# Altium project obc_ver111.PrjPcb (part 1 of 2)
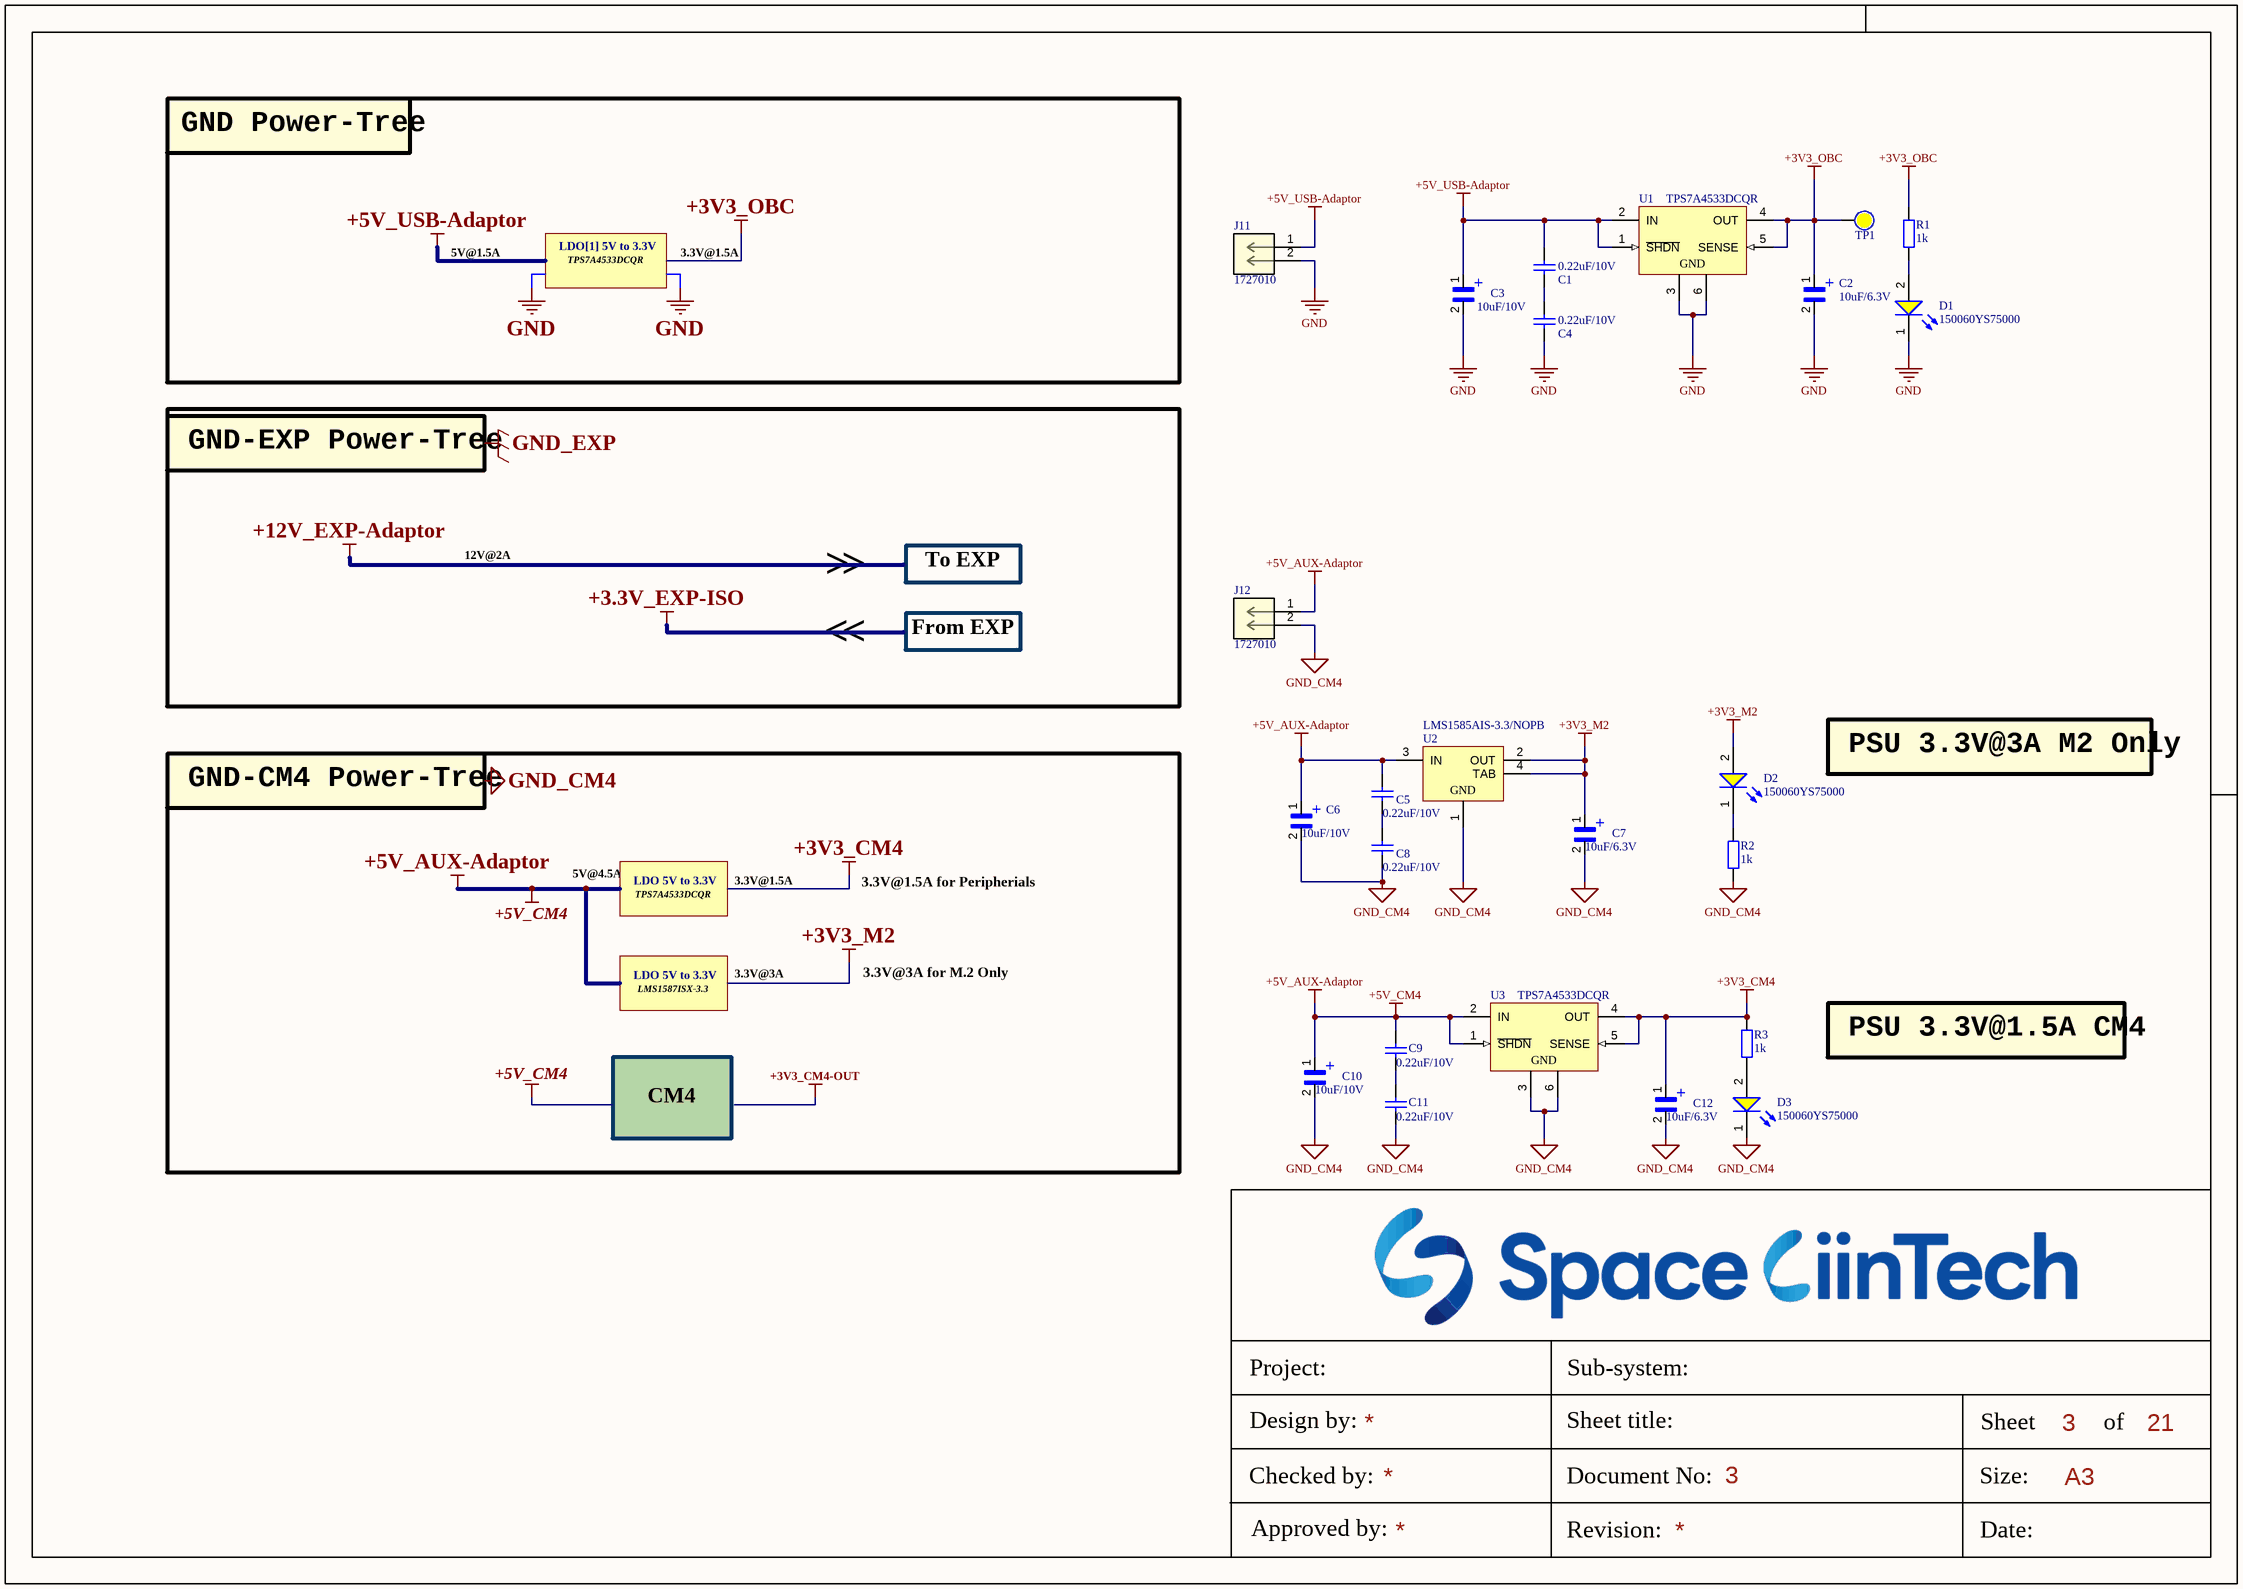
[diagram p0: obc-v2_POWER.SchDoc]
13 sheets, 279 parts. Net scope: flat (ports and power ports of the same name join across sheets).
Board file: OBC_Ver2.PcbDoc
Sheets:
  obc-v2_POWER.SchDoc
  obc-v2_RTC-WDOG.SchDoc
  obc-v2_BOARD-CONNECT.SchDoc
  obc-v2_DEBUG.SchDoc
  obc-v2_EXP-I2C-IRQ.SchDoc
  obc-v2_EXP-CAN-RS422.SchDoc
  obc-v2_CM4-M2.SchDoc
  obc-v2_CM4-PinOut.SchDoc
  obc-v2_CM4-SPI-UART.SchDoc
  obc-v2_CM4-IRQ-CTRL.SchDoc
  obc-v2_CM4-FUNCTION.SchDoc
  obc-v2_MCU-POWER.SchDoc
  obc-v2_MCU-PinOut.SchDoc

## Sheet obc-v2_POWER.SchDoc
size 420 x 297 mm; SheetNumber: 3; SheetTotal: 21

### Parts
C1  0.22uF/10V  [CAP_C_1005X60]
C2  10uF/6.3V  [CAP_MP_2012X170]
C3  10uF/10V  [CAP_MP_2012X170]
C4  0.22uF/10V  [CAP_C_1005X60]
C5  0.22uF/10V  [CAP_C_1005X60]
C6  10uF/10V  [CAP_MP_2012X170]
C7  10uF/6.3V  [CAP_MP_2012X170]
C8  0.22uF/10V  [CAP_C_1005X60]
C9  0.22uF/10V  [CAP_C_1005X60]
C10  10uF/10V  [CAP_MP_2012X170]
C11  0.22uF/10V  [CAP_C_1005X60]
C12  10uF/6.3V  [CAP_MP_2012X170]
D1  150060YS75000  [WL-SMCW_0603_150060xx75000]
D2  150060YS75000  [WL-SMCW_0603_150060xx75000]
D3  150060YS75000  [WL-SMCW_0603_150060xx75000]
J11  1727010  [CONN_1727010]
J12  1727010  [CONN_1727010]
R1  1k  [RES_C_1608X60]
R2  1k  [RES_C_1608X60]
R3  1k  [RES_C_1608X60]
TP1  (no value)  [Test Point 1 Side]  (no BOM)
U1  TPS7A4533DCQR  [DCQ0006A_M]
U2  LMS1585AIS-3.3/NOPB  [TS3B_L]
U3  TPS7A4533DCQR  [DCQ0006A_M]

### Nets
+3V3_CM4: C12.1 R3.2 U3.4(OUT) U3.5(SENSE)
+3V3_M2: C7.1 D2.2(A) U2.2(OUT) U2.4(TAB)
+3V3_OBC: C2.1 R1.2 TP1.0 U1.4(OUT) U1.5(SENSE)
+5V_AUX-Adaptor: C5.1 C6.1 C9.1 C10.1 J12.1 U2.3(IN) U3.1(~{SHDN}) U3.2(IN)  [also labelled +5V_CM4]
+5V_USB-Adaptor: C1.1 C3.1 J11.1 U1.1(~{SHDN}) U1.2(IN)
GND: C2.2 C3.2 C4.2 D1.1(K) J11.2 U1.3(GND) U1.6(GND)
GND_CM4: C6.2 C7.2 C8.2 C10.2 C11.2 C12.2 D3.1(K) J12.2 R2.2 U2.1(GND) U3.3(GND) U3.6(GND)
NetC1_2: C1.2 C4.1
NetC5_2: C5.2 C8.1
NetC9_2: C9.2 C11.1
NetD1_2: D1.2(A) R1.1
NetD2_1: D2.1(K) R2.1
NetD3_2: D3.2(A) R3.1

### Notes on the sheet
- GND Power-Tree
- 5V@1.5A
- LDO[1] 5V to 3.3V
- TPS7A4533DCQR
- 3.3V@1.5A
- GND-EXP Power-Tree
- 12V@2A
- >
- To EXP
- <
- From EXP
- GND-CM4 Power-Tree
- PSU 3.3V@3A M2 Only
- 5V@4.5A
- LDO 5V to 3.3V
- 3.3V@1.5A for Peripherials
- LMS1587ISX-3.3
- 3.3V@3A
- 3.3V@3A for M.2 Only
- PSU 3.3V@1.5A CM4
- CM4
- Labels drawn without touching a wire or pin: GND, GND_CM4, GND_EXP
- Project:
- Sub-system:
- Design by:
- Sheet title:
- Sheet
- A3
- of
- Checked by:
- Approved by:
- Revision:
- Document No:
- Size:
- Date:
- (in symbol TACR686M003RTA) +

### Library data of the parts
C1 C4 C5 C8 C9 C11 = Tu 0402 33nF 10V: CAPC; Chung_Loai: Dán; Don_Vi: Con; So_Chan: 2; Ten_Linh_Kien: Tụ 0402 33nF X7R 10V GRM155R71A333KA01D; Ma_Hang: MH007853; Kieu_Chan: *
C2 C3 C6 C7 C10 C12 = TACR686M003RTA: CAPP; MF: AVX; Availability: Unavailable; SnapEDA_Link: https://www.snapeda.com/parts/TACR686M003RTA/AVX/view-part/1745975/?ref=snap; MP: TACR686M003RTA; Value: *; Price: None; Package: 0805 AVX
D1-D3 = CMP-1426-00005-2: LED YELLOW CLEAR 0603 SMD; NexarPartId: 29687085; Wavelength: 590nm; Luminous Intensity: 120mcd; Peak Wavelength: 595nm; Forward Current: 100mA; Power Dissipation: 72mW; Forward Voltage: 2V; Test Current: 20mA; Reverse Voltage: 5V; Lens Style: Clear, Rectangular; Max Junction Temperature (Tj): 95°C; Viewing Angle: 140°; Case Code (Imperial): 0603; Height: 700µm; REACH SVHC: Unknown; Dominant Wavelength: 590nm; Min Operating Temperature: -40°C; Color: Yellow; Width: 800µm; Mount: Surface Mount; Packaging: Tape and Reel; Max Operating Temperature: 85°C; RoHS: Compliant; Max Reverse Voltage (DC): 5V; Case Code (Metric): 1608; Length: 1.6mm; Case/Package: 0603
J11 J12 = 1727010: No Description Available; Mfr_Name: Phoenix Contact; RefDes: RefDes; Type: Type
R1-R3 = Tro 0603 1% 10k: RES; Chung_Loai: Dán; Don_Vi: Con; So_Chan: 2; Ten_Linh_Kien: Trở 0603 1% 10k; Ma_Hang: MH006333; Kieu_Chan: *
TP1 = Test Point: Solder: NF
U1 U3 = CMP-0395-00360-2: Single Output Fast Transient Response LDO, 1.5 A, Fixed 3.3 V Output, 2.1 to 20 V Input, 6-pin SOT-223 (DCQ), -40 to 125 degC, Green (RoHS & no Sb/Br); Manufacturer: Texas Instruments; Vout Adj(Max)(V): 3.3; Vin(Max)(V): 20; Accuracy(%): 1; SubFamily: Single Channel LDO; Vin(Min)(V): 2.1; Iout(Max)(A): 1.5; Vdo(Typ)(mV): 300; Eco-Plan: Green (RoHS & no Sb/Br); Mounting Technology: Surface Mount; PackageDescription: 6-Pin Plastic Small Outline, Body 3.5 x 6.5 mm, Pitch 1.27 mm; ComponentLink2URL: http://www.ti.com/general/docs/lit/getliterature.tsp?genericPartNumber=TPS7A4533&fileType=pdf; PackageReference: DCQ0006A; ComponentLink3Description: Package Specification; ComponentLink2Description: Datasheet; Fixed Output Options(V): 3.3; Iq(Typ)(mA): 1; ComponentLink1URL: http://www.ti.com/; PartNumber: TPS7A4533DCQR; ComponentLink1Description: Manufacturer URL; PackageVersion: 4202109/D; Vout Adj(Min)(V): 3.3; DatasheetVersion: SLVS720D; ComponentLink3URL: http://www.ti.com/litv/pdf/mpds098c
U2 = CMP-0062-00180-3: 3A Low Dropout Fast Response Regulators, 3-pin TO-263, Pb-Free; PartNumber: LMS1587ISX-3.3/NOPB; Manufacturer: National Semiconductor; PowerWise: N; High-Reliability: Y; PackageTopMarking: NSUZXYTTE#*LMS1587*IS-3.3; CompType: LDO IC; ComponentLink1Description: Manufacturer URL; PackageReference: TS3B; ComponentLink1URL: http://www.national.com/; ComponentLink2URL: http://www.national.com/ds/LM/LMS1587.pdf; DatasheetVersion: Jun-2005; ComponentLink3URL: http://www.national.com/pf/LM/LMS1587.html; RevisionNote: SCH symbol layout adjusted; PinCount: 3; RoHS: Y; Code_JEDEC: MO-169-AA; PackageDescription: TO-263, Molded, .400 x .390 x .180in, 3 Lead, .1in Pitch, Surface Mount; ComponentLink4Description: TS3B Package Page; ComponentLink3Description: LMS1587 Web Page; PackageVersion: revF, Apr-2005; ComponentLink2Description: LMS1587 Datasheet; ComponentLink4URL: http://www.national.com/packaging/folders/ts3b.html

## Sheet obc-v2_RTC-WDOG.SchDoc
size 420 x 297 mm; SheetNumber: 6; SheetTotal: 21
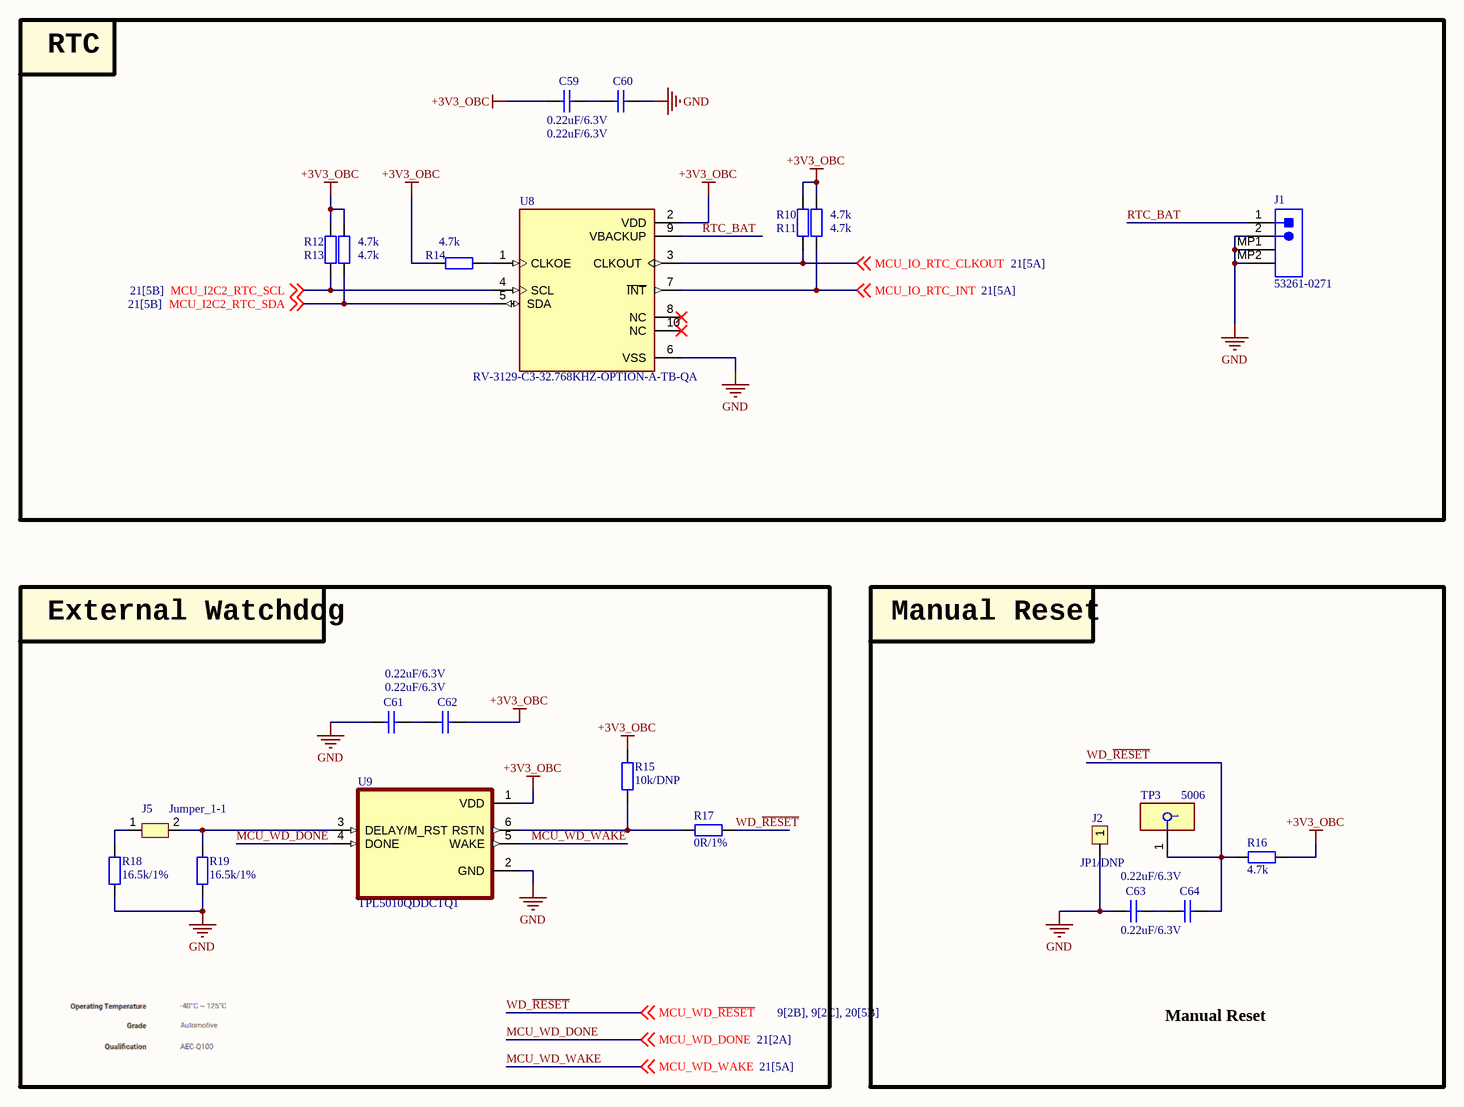
[diagram p1: obc-v2_RTC-WDOG.SchDoc]

### Parts
C59  0.22uF/6.3V  [CAP_C_1005X60]
C60  0.22uF/6.3V  [CAP_C_1005X60]
C61  0.22uF/6.3V  [CAP_C_1005X60]
C62  0.22uF/6.3V  [CAP_C_1005X60]
C63  0.22uF/6.3V  [CAP_C_1005X60]
C64  0.22uF/6.3V  [CAP_C_1005X60]
J1  53261-0271  [MOLX-53261-0271_V]
J2  JP1/DNP  [JP1-D1T]
J5  Jumper_1-1  [Jumper_1-1]
R10  4.7k  [RES_C_1608X60]
R11  4.7k  [RES_C_1608X60]
R12  4.7k  [RES_C_1608X60]
R13  4.7k  [RES_C_1608X60]
R14  4.7k  [RES_C_1608X60]
R15  10k/DNP  [RES_C_1608X60]
R16  4.7k  [RES_C_1608X60]
R17  0R/1%  [RES_C_1608X60]
R18  16.5k/1%  [RES_C_1608X60]
R19  16.5k/1%  [RES_C_1608X60]
TP3  5006  [FP-5006-MFG]
U8  RV-3129-C3-32.768KHZ-OPTION-A-TB-QA  [IC_RV-3129-C3_32.768KHZ_OPTION_A_TB_QA]
U9  TPL5010QDDCTQ1  [SOT95P280X110-6N]

### Blocks framed on the sheet
RTC: C59 C60 J1 R10-R14 U8
External Watchdog: C61 C62 J5 R15 R17-R19 U9
Manual Reset: C63 C64 J2 R16 TP3

### Nets
+3V3_OBC: C59.2 C62.1 R10.2 R11.2 R12.2 R13.2 R14.2 R15.2 R16.2 U8.2(VDD) U9.1(VDD)
GND: C60.1 C61.2 C63.2 J1.2 J1.MP1 J1.MP2 J2.1 R18.1 R19.1 U8.6(VSS) U9.2(GND)
MCU_I2C2_RTC_SCL: R13.1 U8.4(SCL) ; off-sheet MCU_I2C2_RTC_SCL
MCU_I2C2_RTC_SDA: R12.1 U8.5(SDA) ; off-sheet MCU_I2C2_RTC_SDA
MCU_IO_RTC_CLKOUT: R11.1 U8.3(CLKOUT) ; off-sheet MCU_IO_RTC_CLKOUT
MCU_IO_RTC_INT: R10.1 U8.7(~{INT}) ; off-sheet MCU_IO_RTC_INT
MCU_WD_DONE: U9.4(DONE) ; off-sheet MCU_WD_DONE
MCU_WD_~{RESET}: C64.1 R16.1 R17.1 TP3.1 ; off-sheet MCU_WD_~{RESET}  [also labelled WD_~{RESET}]  [project net MCU_~{RST}]
MCU_WD_WAKE: U9.5(WAKE) ; off-sheet MCU_WD_WAKE
RTC_BAT: J1.1 U8.9(VBACKUP)
NetC59_1: C59.1 C60.2
NetC61_1: C61.1 C62.2
NetC63_1: C63.1 C64.2
NetJ5_1: J5.1 R18.2
NetJ5_2: J5.2 R19.2 U9.3(DELAY/M_RST)
NetR14_1: R14.1 U8.1(CLKOE)
NetR15_1: R15.1 R17.2 U9.6(RSTN)

Not connected (* = marked no-connect by the designer): U8 8(NC)* 10(NC)*

### Notes on the sheet
- Manual Reset
- Project:
- Sub-system:
- Design by:
- Sheet title:
- Sheet
- A3
- of
- Checked by:
- Approved by:
- Revision:
- Document No:
- Size:
- Date:

### Library data of the parts
C59-C64 = Tu 0402 33nF 10V: as C1 on sheet obc-v2_POWER; Kieu_Chan: *
J1 = CMP-2000-05633-1: PicoBlade(TM) Header, Right Angle, -40 to 85 degC, 2-Pin SMD, RoHS, Tape and Reel; Current - Max: 1A; Brand: Molex; Voltage Rating: 125V; Number of Positions: 2; Pitch: 1.25mm; Package Version: Rev. H, 11/2014; Factory Pack Quantity: 1000; Datasheet URL: http://www.molex.com/webdocs/datasheets/pdf/en-us/0532610271_PCB_HEADERS.pdf; Datasheet Version: 03/2016; Housing Material: Thermoplastic; RoHS: Details; Product Type: Headers; Number of Rows: 1; Termination Style: SMD; Mounting Technology: SurfaceMount; Number of Positions / Contacts: 2; Package URL: http://www.molex.com/pdm_docs/sd/532610271_sd.pdf; Mounting Angle: Right; Mounting Style: SMD/SMT; Manufacturer: Molex; Product Category: 1.25mmConnectors; Tradename: PicoBlade; Voltage - Max: 125V; Manufacturer URL: http://www.molex.com/; Series: 53261; Package Description: 2-Leads Header, Pitch 1.25 mm, Mated Height 3.4 mm; Package Reference: 53261-0271; Current Rating: 1A; Contact Plating: Tin; Contact Material: PhosphorBronze; Type: Shrouded; Packaging: Reel
J2 = JP1: WR-PHD 2.54 mm Angled Socket Header; Manufacturer: W¨¹rth Elektronik eiSos GmbH; partNo: 613002143121; ComponentLink1 Description: Manufacturer; ComponentLink2 Description: Datasheet; NoPins: 02; Created Date: 29 March 2013; ComponentLink1URL: http://www.we-online.com; ComponentLink2URL: http://katalog.we-online.de/em/datasheet/6130xx143121.pdf; Created by: Karrer Zheng
J5 = Jumper_1_1
R10-R14 R16 R17 = Tro 0603 1% 10k: as R1 on sheet obc-v2_POWER; Kieu_Chan: *
R15 = Tro 0603 1% 10k: RES SMD 10K OHM 1% 1/10W 0603, P/N: ERJ-3EKF1002V; Chung_Loai: Dán; Don_Vi: Con; So_Chan: 2; Ten_Linh_Kien: Trở 0603 1% 10k; Ma_Hang: MH006333; Kieu_Chan: *
R18 = Tro 0603 1% 10k: RES SMD 19.1K OHM 1% 1/10W 0603, P/N: ERJ-3EKF1912V; Chung_Loai: Dán; Don_Vi: Con; So_Chan: 2; Ten_Linh_Kien: Trở 0603 1% 10k; Ma_Hang: MH006333; Kieu_Chan: *
R19 = Tro 0603 1% 10k: RES SMD 16.5K OHM 1% 1/10W 0603, P/N: ERJ-3EKF1652V; Chung_Loai: Dán; Don_Vi: Con; So_Chan: 2; Ten_Linh_Kien: Trở 0603 1% 10k; Ma_Hang: MH006333; Kieu_Chan: *
TP3 = CMP-19636-000022-1: PC TEST POINT COMPACT BLACK; Body Material: Bronze; Inside Diameter: 1.78mm; Number of Ports: 1; Hole Diameter: 1.6mm; Outside Diameter: 3.18mm; Plating: Silver; Contact Plating: Tin; Color: Black; RoHS Compliant: Yes; Flammability Rating: UL94 V-0; Contact Material: Bronze; Material: Nylon; Orientation: Straight; Package Quantity: 100; Housing Color: Black; Length: 8.89mm; Series: THM; Mount: PCB; Height: 0.35inch; Packaging: Bulk; REACH SVHC: No SVHC; Insulation Material: Nylon; Lead Free: Lead Free
U8 = RV-3129-C3_32.768KHZ_OPTION_A_TB_QA: Real-Time Clock Module, Temperature compensated, in 2.5 x 3.7 mm package; MF: Micro Crystal; MP: RV-3129-C3 32.768KHZ OPTION A TB QA; SnapEDA_Link: https://www.snapeda.com/parts/RV-3129-C3%2032.768KHZ%20OPTION%20A%20TB%20QA/Micro+Crystal/view-part/?ref=snap; Package: QFN-10 Micro Crystal; Value: *; Check_prices: https://www.snapeda.com/parts/RV-3129-C3%2032.768KHZ%20OPTION%20A%20TB%20QA/Micro+Crystal/view-part/?ref=eda
U9 = TPL5010QDDCTQ1: Package: None; Price: None; Value: *; MP: TPL5010QDDCTQ1; Availability: Unavailable

## Sheet obc-v2_BOARD-CONNECT.SchDoc
size 420 x 297 mm; SheetNumber: 8; SheetTotal: 21
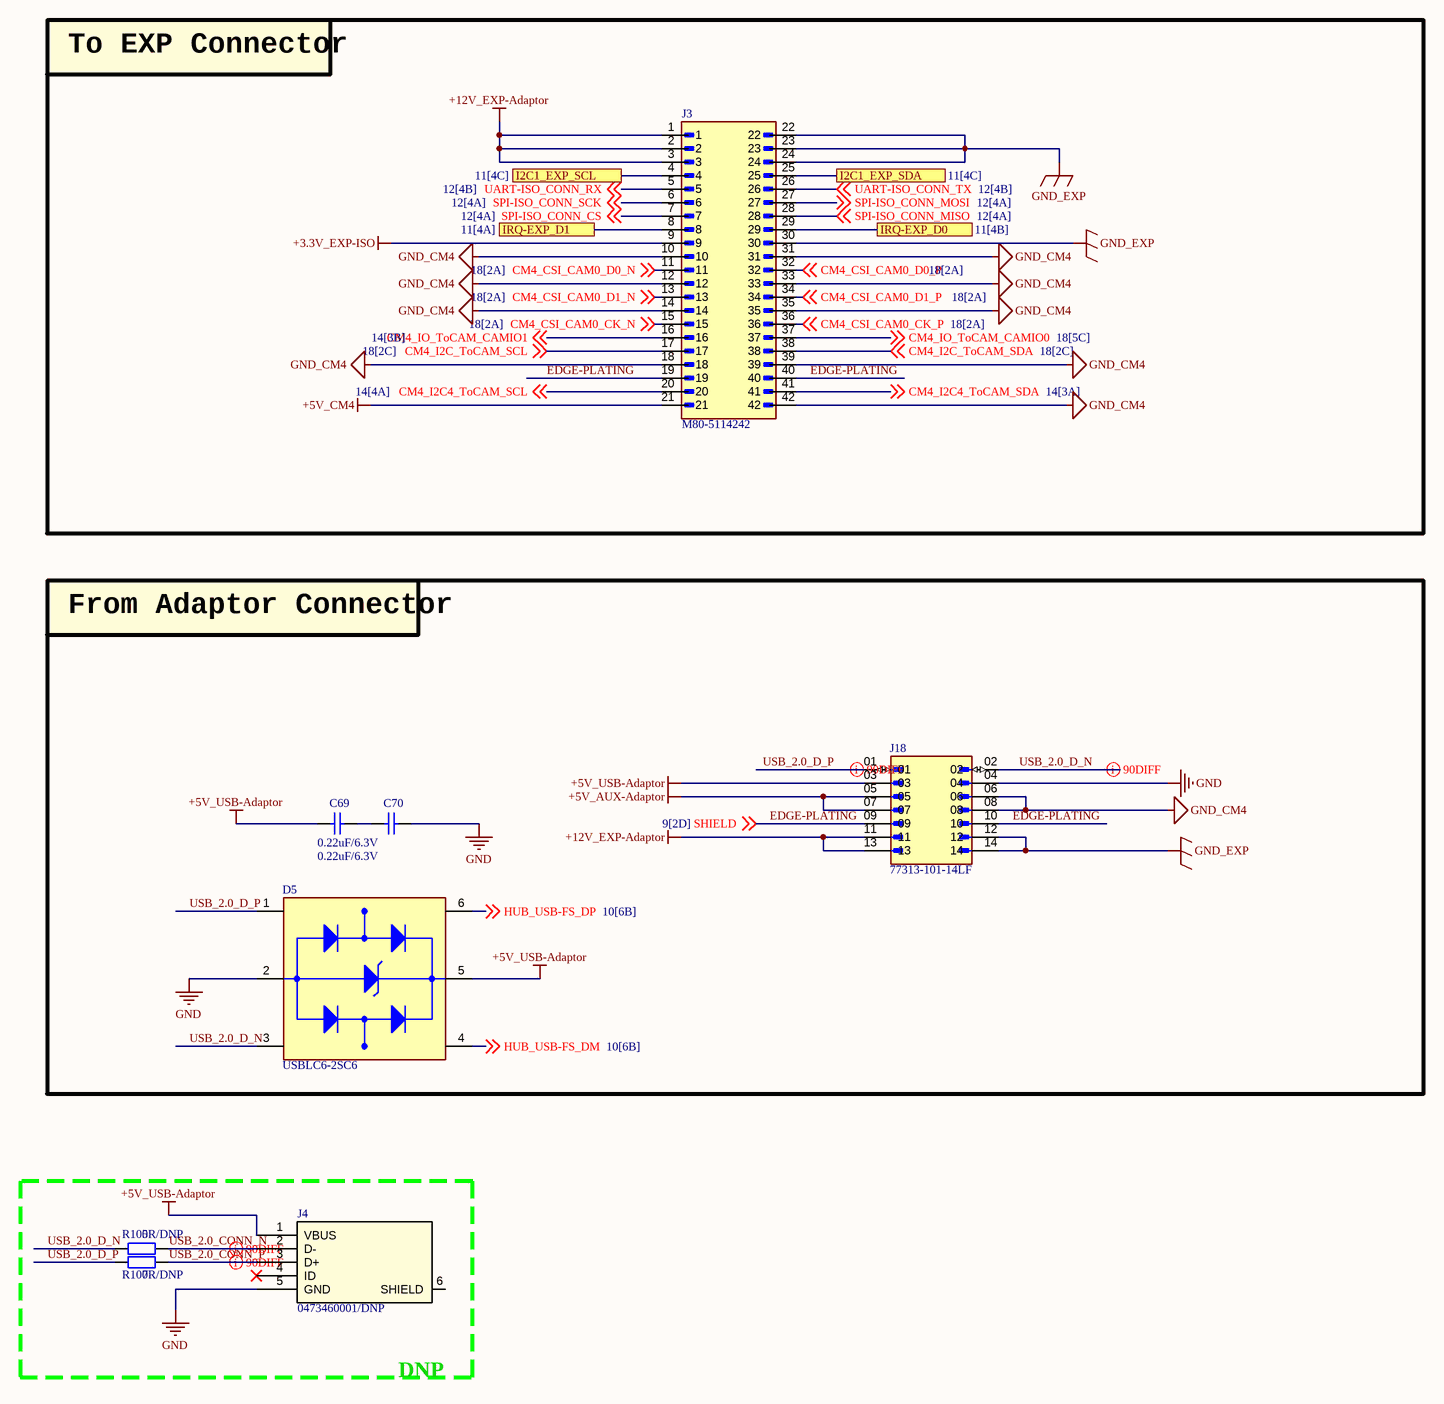
[diagram p2: obc-v2_BOARD-CONNECT.SchDoc]

### Parts
C69  0.22uF/6.3V  [CAP_C_1005X60]
C70  0.22uF/6.3V  [CAP_C_1005X60]
D5  USBLC6-2SC6  [SOT95P280X145-6N]
J3  M80-5114242  [HARWIN_M80-5114242 - duplicate]
J4  0473460001/DNP  [47346-0001_MOL]
J18  77313-101-14LF  [AMPHENOL_77313-101-14LF]
R105  0R/DNP  [RES_C_1608X60]
R107  0R/DNP  [RES_C_1608X60]

### Blocks framed on the sheet
To EXP Connector: J3
From Adaptor Connector: C69 C70 D5 J18

### Ports
I2C1_EXP_SCL (see 11[4C]), I2C1_EXP_SDA (see 11[4C]), IRQ-EXP_D0 (see 11[4B]), IRQ-EXP_D1 (see 11[4A])

### Nets
+3.3V_EXP-ISO: J3.9
+5V_AUX-Adaptor: J3.21 J18.05 J18.07  [also labelled +5V_CM4]
+5V_USB-Adaptor: C69.2 D5.5(VBUS) J4.1(VBUS) J18.03
+12V_EXP-Adaptor: J3.1 J3.2 J3.3 J18.11 J18.13
GND: C70.1 D5.2(GND) J4.5(GND) J18.04
GND_CM4: J3.10 J3.12 J3.14 J3.18 J3.31 J3.33 J3.35 J3.39 J3.42 J18.06 J18.08
GND_EXP: J3.22 J3.23 J3.24 J3.30 J18.12 J18.14
CM4_CSI_CAM0_CK_N: J3.15 ; off-sheet CM4_CSI_CAM0_CK_N
CM4_CSI_CAM0_CK_P: J3.36 ; off-sheet CM4_CSI_CAM0_CK_P
CM4_CSI_CAM0_D0_N: J3.11 ; off-sheet CM4_CSI_CAM0_D0_N
CM4_CSI_CAM0_D0_P: J3.32 ; off-sheet CM4_CSI_CAM0_D0_P
CM4_CSI_CAM0_D1_N: J3.13 ; off-sheet CM4_CSI_CAM0_D1_N
CM4_CSI_CAM0_D1_P: J3.34 ; off-sheet CM4_CSI_CAM0_D1_P
CM4_I2C4_ToCAM_SCL: J3.20 ; off-sheet CM4_I2C4_ToCAM_SCL
CM4_I2C4_ToCAM_SDA: J3.41 ; off-sheet CM4_I2C4_ToCAM_SDA
CM4_I2C_ToCAM_SCL: J3.17 ; off-sheet CM4_I2C_ToCAM_SCL
CM4_I2C_ToCAM_SDA: J3.38 ; off-sheet CM4_I2C_ToCAM_SDA
CM4_IO_ToCAM_CAMIO0: J3.37 ; off-sheet CM4_IO_ToCAM_CAMIO0
CM4_IO_ToCAM_CAMIO1: J3.16 ; off-sheet CM4_IO_ToCAM_CAMIO1
EDGE-PLATING: J3.19 J3.40 J18.09 J18.10 ; off-sheet SHIELD  [also labelled SHIELD]
HUB_USB-FS_DM: D5.4(I/O2_OUT) ; off-sheet HUB_USB-FS_DM
HUB_USB-FS_DP: D5.6(I/O1_OUT) ; off-sheet HUB_USB-FS_DP
SPI-ISO_CONN_CS: J3.7 ; off-sheet SPI-ISO_CONN_CS
SPI-ISO_CONN_MISO: J3.28 ; off-sheet SPI-ISO_CONN_MISO
SPI-ISO_CONN_MOSI: J3.27 ; off-sheet SPI-ISO_CONN_MOSI
SPI-ISO_CONN_SCK: J3.6 ; off-sheet SPI-ISO_CONN_SCK
UART-ISO_CONN_RX: J3.5 ; off-sheet UART-ISO_CONN_RX
UART-ISO_CONN_TX: J3.26 ; off-sheet UART-ISO_CONN_TX
USB_2.0_CONN_N: J4.2(D-) R105.1
USB_2.0_CONN_P: J4.3(D+) R107.1
USB_2.0_D_N: D5.3(I/O2_IN) J18.02 R105.2
USB_2.0_D_P: D5.1(I/O1_IN) J18.01 R107.2
NetC69_1: C69.1 C70.2
NetJ3_4: J3.4 ; port I2C1_EXP_SCL
NetJ3_8: J3.8 ; port IRQ-EXP_D1
NetJ3_25: J3.25 ; port I2C1_EXP_SDA
NetJ3_29: J3.29 ; port IRQ-EXP_D0

Not connected (* = marked no-connect by the designer): J4 4(ID)* 6(SHIELD)

### Layout directives
differential pair; differential pair class DIFF90: USB_2.0_CONN_N, USB_2.0_CONN_P, USB_2.0_D_N, USB_2.0_D_P

### Notes on the sheet
- DNP
- Project:
- Sub-system:
- Design by:
- Sheet title:
- Sheet
- A3
- of
- Checked by:
- Approved by:
- Revision:
- Document No:
- Size:
- Date:

### Library data of the parts
C69 C70 = Tu 0402 33nF 10V: as C1 on sheet obc-v2_POWER; Kieu_Chan: *
D5 = USBLC6-2SC6: 17V Clamp 5A (8/20Âµs) Ipp Tvs Diode Surface Mount SOT-23-6; MF: STMicroelectronics; Value: *; SnapEDA_Link: https://www.snapeda.com/parts/USBLC6-2SC6/STMicroelectronics/view-part/?ref=snap; Check_prices: https://www.snapeda.com/parts/USBLC6-2SC6/STMicroelectronics/view-part/?ref=eda; Purchase-URL: https://pricing.snapeda.com/search/part/USBLC6-2SC6/?ref=eda; Price: None; Availability: In Stock; Package: SOT-23-6 STMicroelectronics; MP: USBLC6-2SC6
J4 = USB_micro: No Description Available; Mfr_Name: Molex Connector Corporation; RefDes: RefDes; Type: Type
J18 = 77313-101-14LF: MF: AMPHENOL ICC / FCI; Package: None; Price: None; Value: *; MP: 77313-101-14LF; Availability: Unavailable
R105 R107 = Tro 0603 1% 1k: RES SMD 12K OHM 1% 1/10W 0603, P/N: ERJ-3EKF1202V; Chung_Loai: Dán; So_Chan: 2; Don_Vi: Con; Ten_Linh_Kien: Trở 0603 1% 1k; Ma_Hang: MH006334; Kieu_Chan: *
J3 = M80-5114242: Package: None; Price: None; Value: *; MP: M80-5114242; Availability: Unavailable

## Sheet obc-v2_DEBUG.SchDoc
size 420 x 297 mm; SheetNumber: 9; SheetTotal: 21
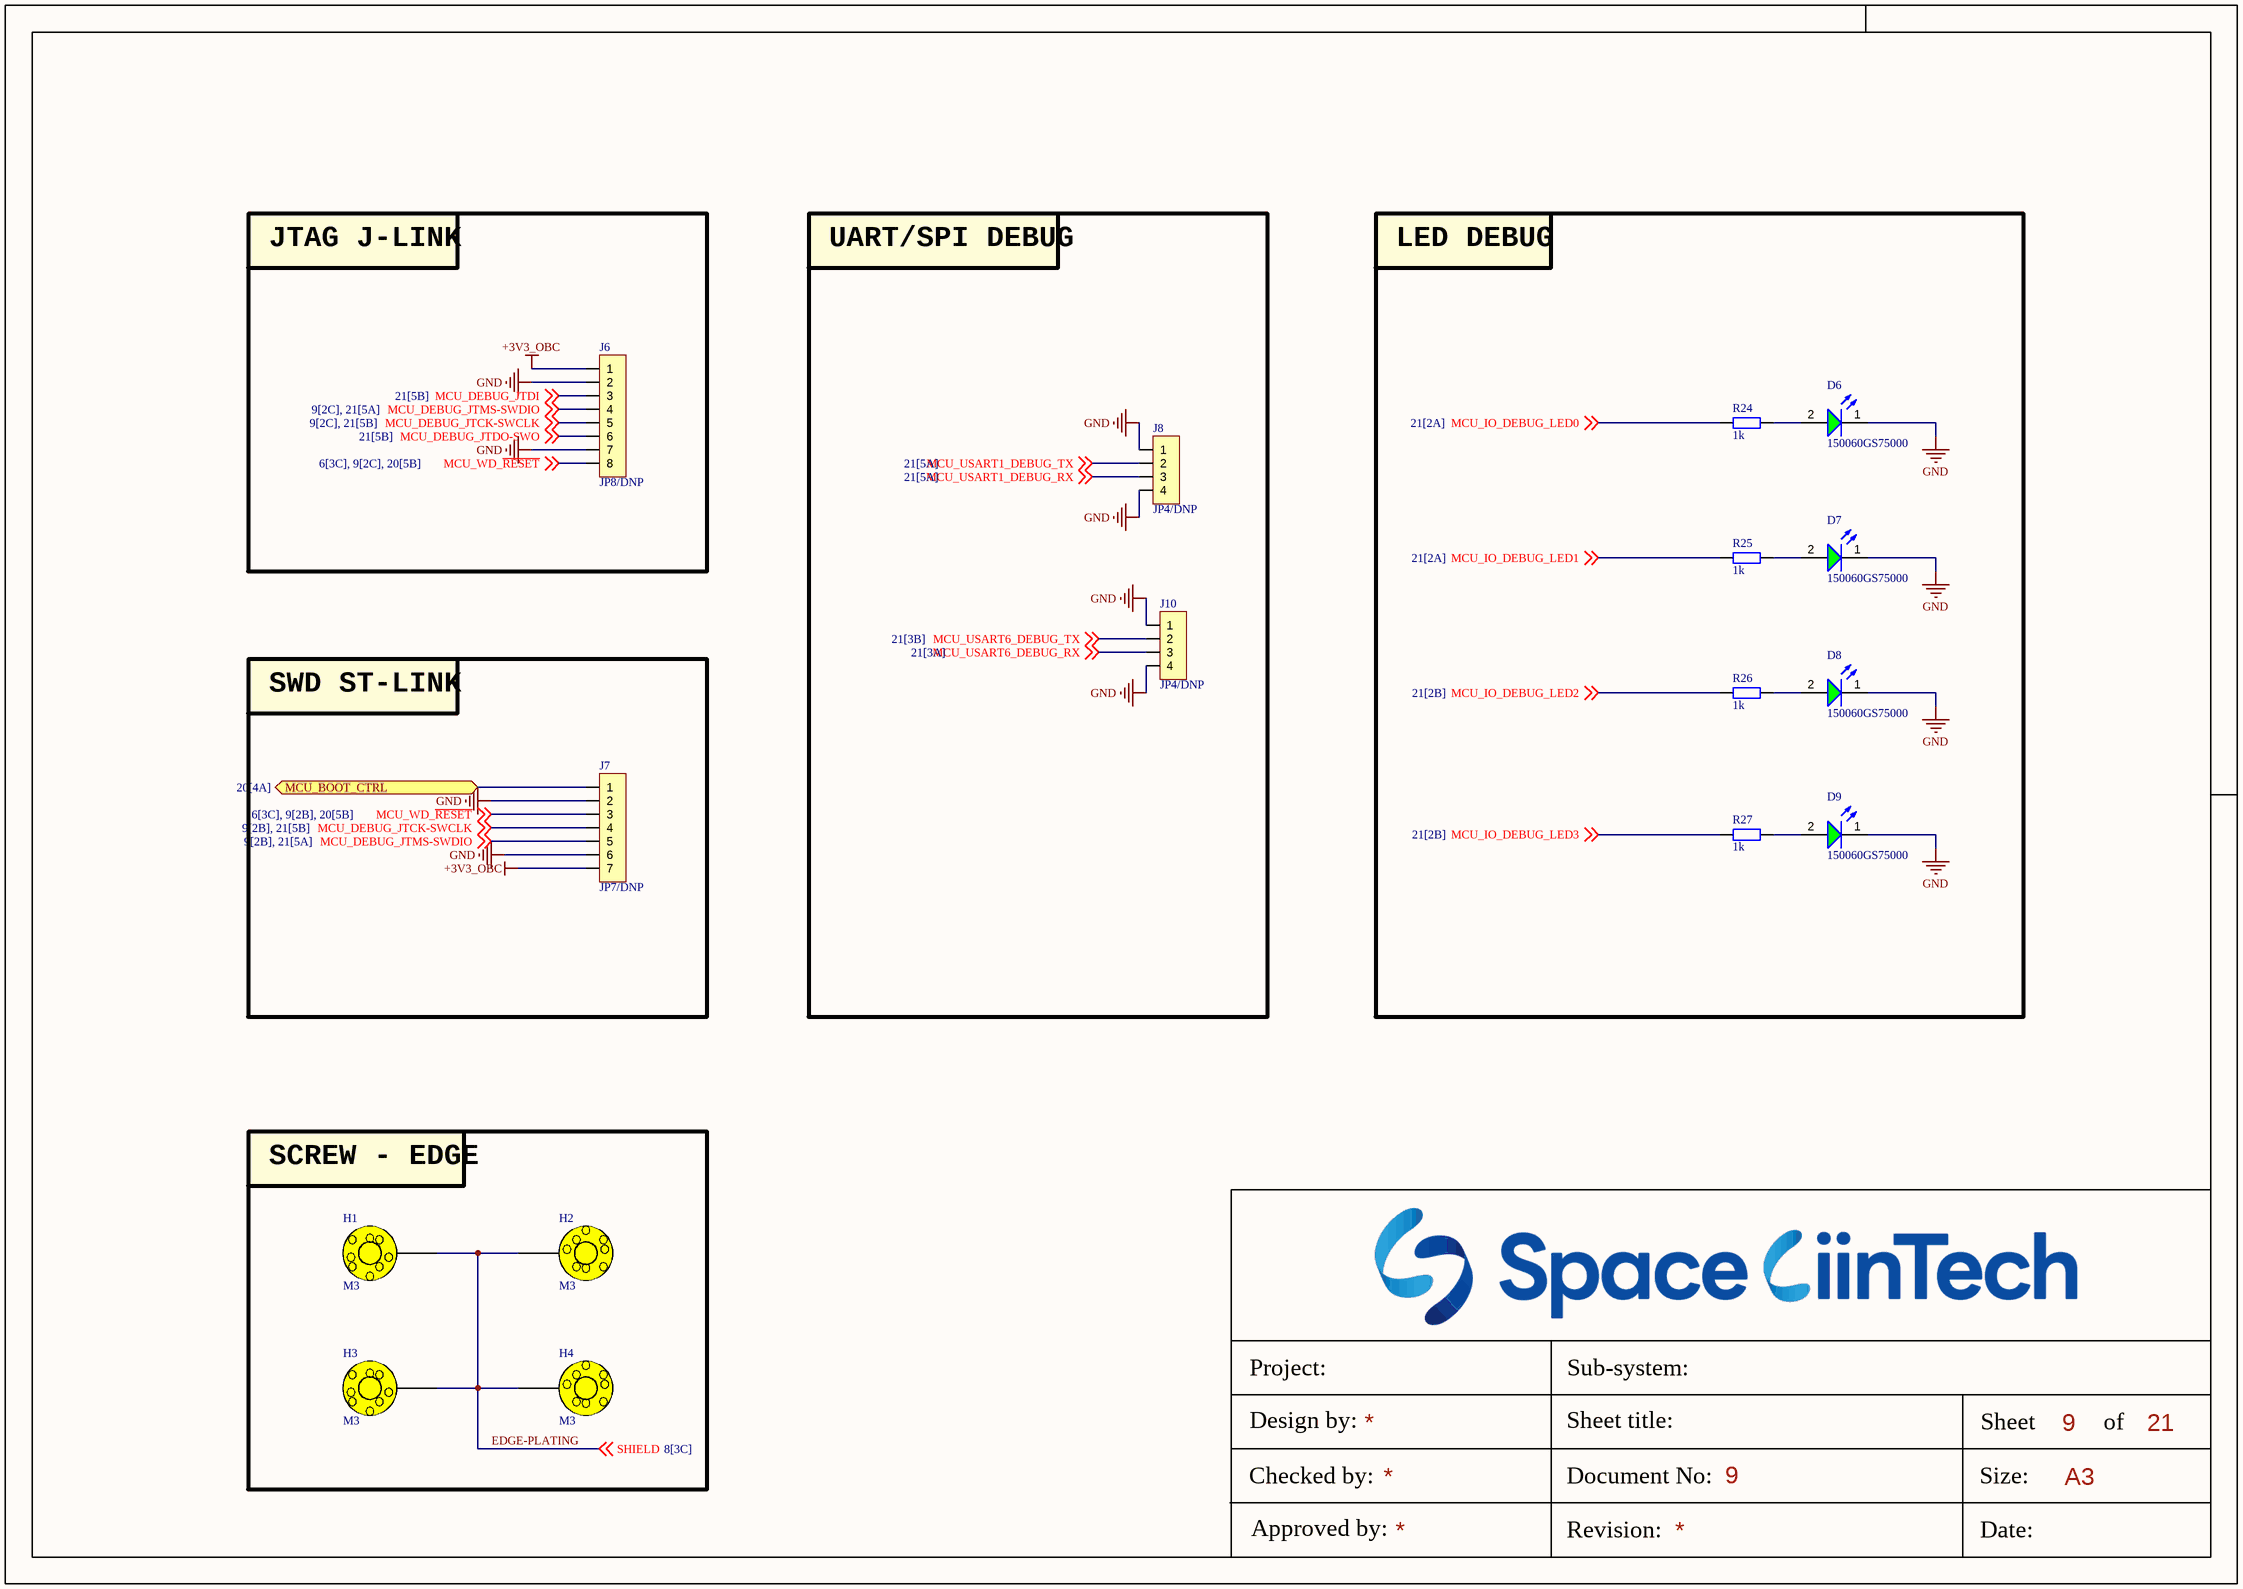
[diagram p3: obc-v2_DEBUG.SchDoc]

### Parts
D6  150060GS75000  [WL-SMCW_0603_150060xx75000]
D7  150060GS75000  [WL-SMCW_0603_150060xx75000]
D8  150060GS75000  [WL-SMCW_0603_150060xx75000]
D9  150060GS75000  [WL-SMCW_0603_150060xx75000]
H1  M3  [HEX-M3]
H2  M3  [HEX-M3]
H3  M3  [HEX-M3]
H4  M3  [HEX-M3]
J6  JP8/DNP  [JP8-C1T]
J7  JP7/DNP  [JP7-C1T]
J8  JP4/DNP  [JP4-C1T]
J10  JP4/DNP  [JP4-C1T]
R24  1k  [RES_C_1608X60]
R25  1k  [RES_C_1608X60]
R26  1k  [RES_C_1608X60]
R27  1k  [RES_C_1608X60]

### Blocks framed on the sheet
JTAG J-LINK: J6
UART/SPI DEBUG: J8 J10
LED DEBUG: D6-D9 R24-R27
SWD ST-LINK: J7
SCREW - EDGE: H1-H4

### Ports
MCU_BOOT_CTRL (bidir, see 20[4A])

### Nets
+3V3_OBC: J6.1 J7.7
GND: D6.1(K) D7.1(K) D8.1(K) D9.1(K) J6.2 J6.7 J7.2 J7.6 J8.1 J8.4 J10.1 J10.4
EDGE-PLATING: H1.1 H2.1 H3.1 H4.1 ; off-sheet SHIELD  [also labelled SHIELD]
MCU_BOOT0: J7.1 ; port MCU_BOOT_CTRL
MCU_DEBUG_JTCK-SWCLK: J6.5 J7.4 ; off-sheet MCU_DEBUG_JTCK-SWCLK
MCU_DEBUG_JTDI: J6.3 ; off-sheet MCU_DEBUG_JTDI
MCU_DEBUG_JTDO-SWO: J6.6 ; off-sheet MCU_DEBUG_JTDO-SWO
MCU_DEBUG_JTMS-SWDIO: J6.4 J7.5 ; off-sheet MCU_DEBUG_JTMS-SWDIO
MCU_IO_DEBUG_LED0: R24.2 ; off-sheet MCU_IO_DEBUG_LED0
MCU_IO_DEBUG_LED1: R25.2 ; off-sheet MCU_IO_DEBUG_LED1
MCU_IO_DEBUG_LED2: R26.2 ; off-sheet MCU_IO_DEBUG_LED2
MCU_IO_DEBUG_LED3: R27.2 ; off-sheet MCU_IO_DEBUG_LED3
MCU_USART1_DEBUG_RX: J8.3 ; off-sheet MCU_USART1_DEBUG_RX
MCU_USART1_DEBUG_TX: J8.2 ; off-sheet MCU_USART1_DEBUG_TX
MCU_USART6_DEBUG_RX: J10.3 ; off-sheet MCU_USART6_DEBUG_RX
MCU_USART6_DEBUG_TX: J10.2 ; off-sheet MCU_USART6_DEBUG_TX
MCU_WD_~{RESET}: J6.8 J7.3 ; off-sheet MCU_WD_~{RESET}  [project net MCU_~{RST}]
NetD6_2: D6.2(A) R24.1
NetD7_2: D7.2(A) R25.1
NetD8_2: D8.2(A) R26.1
NetD9_2: D9.2(A) R27.1

### Notes on the sheet
- Project:
- Sub-system:
- Design by:
- Sheet title:
- Sheet
- A3
- of
- Checked by:
- Approved by:
- Revision:
- Document No:
- Size:
- Date:

### Library data of the parts
D6-D9 = CMP-1426-00002-4: 430mcd Colorless transparence 520nm Emerald 140° LED0603 Light Emitting Diodes (LED) ROHS; Peak Wavelength: 515nm; Forward Current: 100mA; Reverse Voltage: 5V; Output Current: 10µA; Power Dissipation: 105mW; Lens Style: Clear, Rectangular; Dominant Wavelength: 525nm; Color: Green; Test Current: 20mA; Max Junction Temperature (Tj): 95°C; Forward Voltage: 3.2V; Width: 800µm; Max Operating Temperature: 85°C; Case Code (Metric): 1608; Luminous Intensity: 430mcd; Lead Free: Lead Free; Case/Package: 0603; Case Code (Imperial): 0603; Mount: Surface Mount; Max Reverse Voltage (DC): 5V; Packaging: Tape and Reel; RoHS: Compliant; Viewing Angle: 140°; REACH SVHC: Unknown; Min Operating Temperature: -40°C; Height: 700µm; Wavelength: 525nm; Length: 1.6mm
H1-H4 = HEX-M3
J6 = JP8
J7 = JP7
J8 J10 = JP4: WR-PHD 2.54 mm Angled Socket Header; Manufacturer: W¨¹rth Elektronik eiSos GmbH; partNo: 613004143121; ComponentLink1 Description: Manufacturer; ComponentLink2 Description: Datasheet; NoPins: 04; Created Date: 29 March 2013; ComponentLink1URL: http://www.we-online.com; ComponentLink2URL: http://katalog.we-online.de/em/datasheet/6130xx143121.pdf; Created by: Karrer Zheng
R24-R27 = Tro 0603 1% 10k: as R1 on sheet obc-v2_POWER; Kieu_Chan: *

## Sheet obc-v2_EXP-I2C-IRQ.SchDoc
size 420 x 297 mm; SheetNumber: 11; SheetTotal: 21
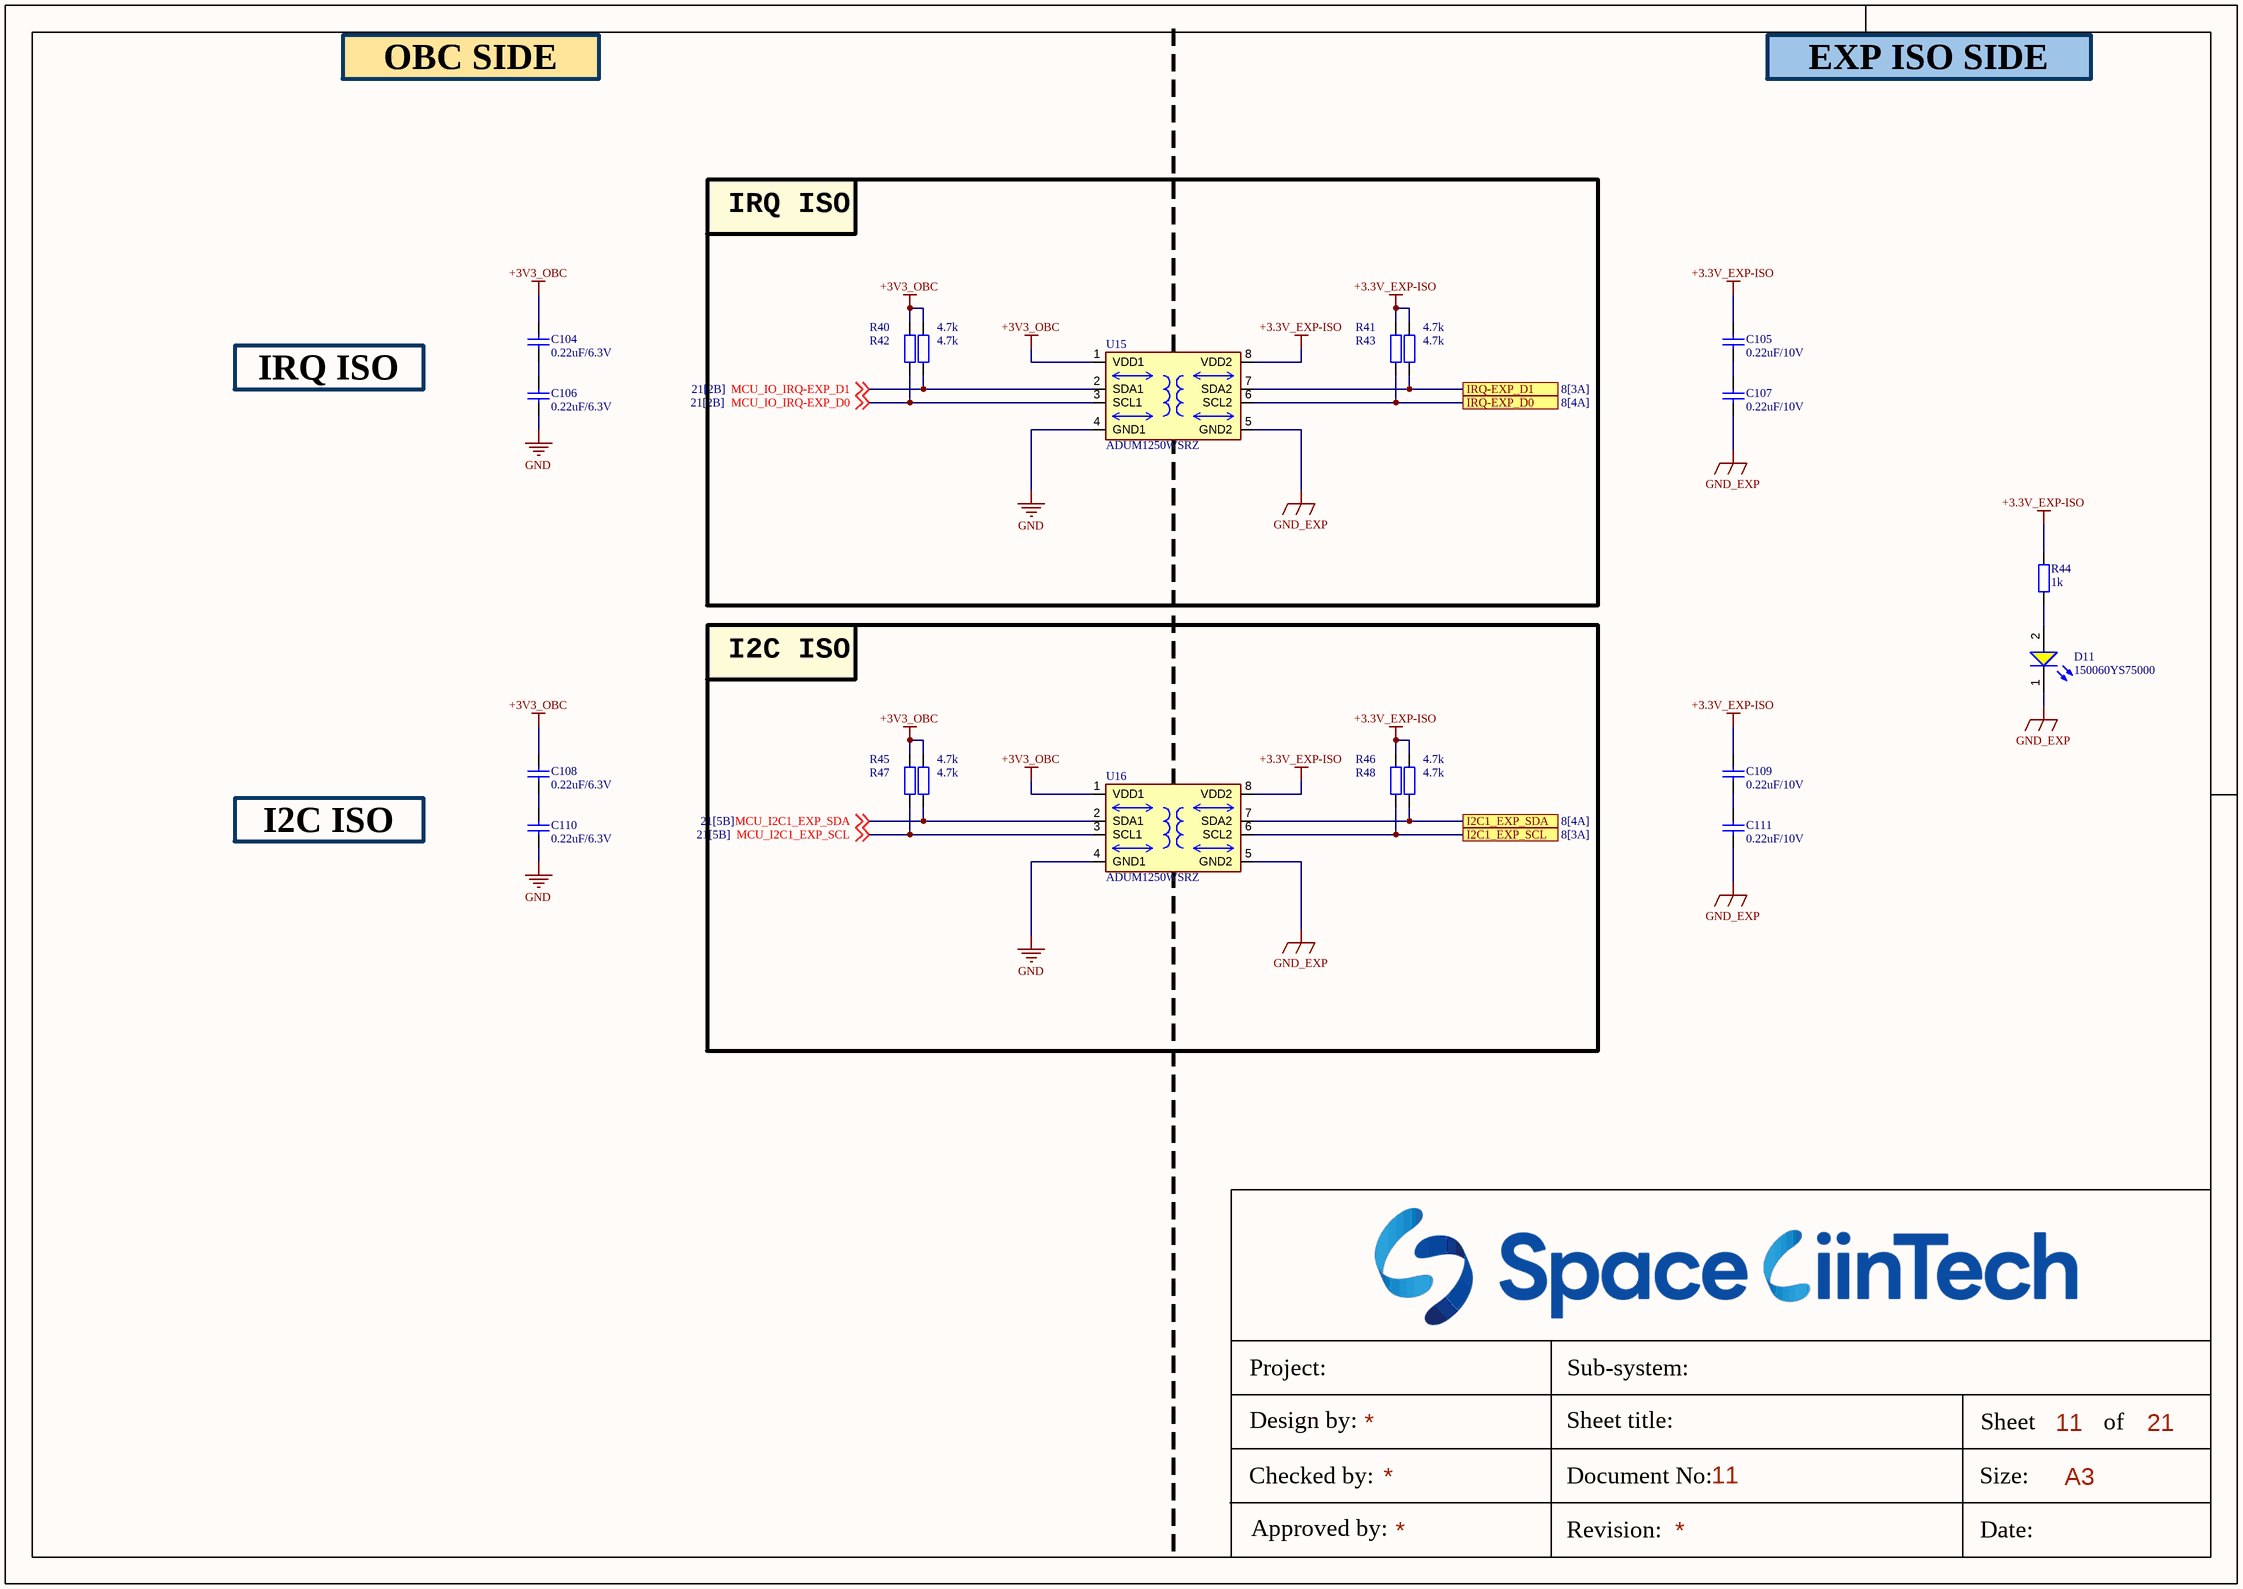
[diagram p4: obc-v2_EXP-I2C-IRQ.SchDoc]

### Parts
C104  0.22uF/6.3V  [CAP_C_1005X60]
C105  0.22uF/10V  [CAP_C_1005X60]
C106  0.22uF/6.3V  [CAP_C_1005X60]
C107  0.22uF/10V  [CAP_C_1005X60]
C108  0.22uF/6.3V  [CAP_C_1005X60]
C109  0.22uF/10V  [CAP_C_1005X60]
C110  0.22uF/6.3V  [CAP_C_1005X60]
C111  0.22uF/10V  [CAP_C_1005X60]
D11  150060YS75000  [WL-SMCW_0603_150060xx75000]
R40  4.7k  [RES_C_1608X60]
R41  4.7k  [RES_C_1608X60]
R42  4.7k  [RES_C_1608X60]
R43  4.7k  [RES_C_1608X60]
R44  1k  [RES_C_1608X60]
R45  4.7k  [RES_C_1608X60]
R46  4.7k  [RES_C_1608X60]
R47  4.7k  [RES_C_1608X60]
R48  4.7k  [RES_C_1608X60]
U15  ADUM1250WSRZ  [SOIC127P602X173-8N]
U16  ADUM1250WSRZ  [SOIC127P602X173-8N]

### Blocks framed on the sheet
IRQ ISO: R40-R43 U15
I2C ISO: R45-R48 U16

### Ports
I2C1_EXP_SCL (see 8[3A]), I2C1_EXP_SDA (see 8[4A]), IRQ-EXP_D0 (see 8[4A]), IRQ-EXP_D1 (see 8[3A])

### Nets
+3.3V_EXP-ISO: C105.1 C109.1 R41.2 R43.2 R44.2 R46.2 R48.2 U15.8(VDD2) U16.8(VDD2)
+3V3_OBC: C104.1 C108.1 R40.2 R42.2 R45.2 R47.2 U15.1(VDD1) U16.1(VDD1)
GND: C106.2 C110.2 U15.4(GND1) U16.4(GND1)
GND_EXP: C107.2 C111.2 D11.1(K) U15.5(GND2) U16.5(GND2)
MCU_I2C1_EXP_SCL: R45.1 U16.3(SCL1) ; off-sheet MCU_I2C1_EXP_SCL
MCU_I2C1_EXP_SDA: R47.1 U16.2(SDA1) ; off-sheet MCU_I2C1_EXP_SDA
MCU_IO_IRQ-EXP_D0: R40.1 U15.3(SCL1) ; off-sheet MCU_IO_IRQ-EXP_D0
MCU_IO_IRQ-EXP_D1: R42.1 U15.2(SDA1) ; off-sheet MCU_IO_IRQ-EXP_D1
NetC104_2: C104.2 C106.1
NetC105_2: C105.2 C107.1
NetC108_2: C108.2 C110.1
NetC109_2: C109.2 C111.1
NetD11_2: D11.2(A) R44.1
NetJ3_4: R46.1 U16.6(SCL2) ; port I2C1_EXP_SCL
NetJ3_8: R43.1 U15.7(SDA2) ; port IRQ-EXP_D1
NetJ3_25: R48.1 U16.7(SDA2) ; port I2C1_EXP_SDA
NetJ3_29: R41.1 U15.6(SCL2) ; port IRQ-EXP_D0

### Notes on the sheet
- OBC SIDE
- EXP ISO SIDE
- IRQ ISO
- I2C ISO
- Project:
- Sub-system:
- Design by:
- Sheet title:
- Sheet
- A3
- of
- Checked by:
- Approved by:
- Revision:
- Document No:
- Size:
- Date:

### Library data of the parts
C104-C111 = Tu 0402 33nF 10V: as C1 on sheet obc-v2_POWER; Kieu_Chan: *
D11 = CMP-1426-00005-2: as D1 on sheet obc-v2_POWER; Case Code (Imperial): 0603; Height: 700µm; REACH SVHC: Unknown; Dominant Wavelength: 590nm; Min Operating Temperature: -40°C; Color: Yellow; Width: 800µm; Mount: Surface Mount; Packaging: Tape and Reel; Max Operating Temperature: 85°C; RoHS: Compliant; Max Reverse Voltage (DC): 5V; Case Code (Metric): 1608; Length: 1.6mm; Case/Package: 0603
R40-R48 = Tro 0603 1% 10k: as R1 on sheet obc-v2_POWER; Kieu_Chan: *
U15 U16 = ADUM1250: IÂ²C Digital Isolator 2500Vrms 2 Channel 1Mbps 25kV/Âµs CMTI 8-SOIC (0.154", 3.90mm Width); MF: Analog Devices; Package: SOIC-8; Price: None; Value: *; SnapEDA_Link: https://www.snapeda.com/parts/ADUM1250/Analog+Devices/view-part/?ref=snap; MP: ADUM1250; Availability: Unavailable; Check_prices: https://www.snapeda.com/parts/ADUM1250/Analog+Devices/view-part/?ref=eda

## Sheet obc-v2_EXP-CAN-RS422.SchDoc
size 420 x 297 mm; SheetNumber: 12; SheetTotal: 21
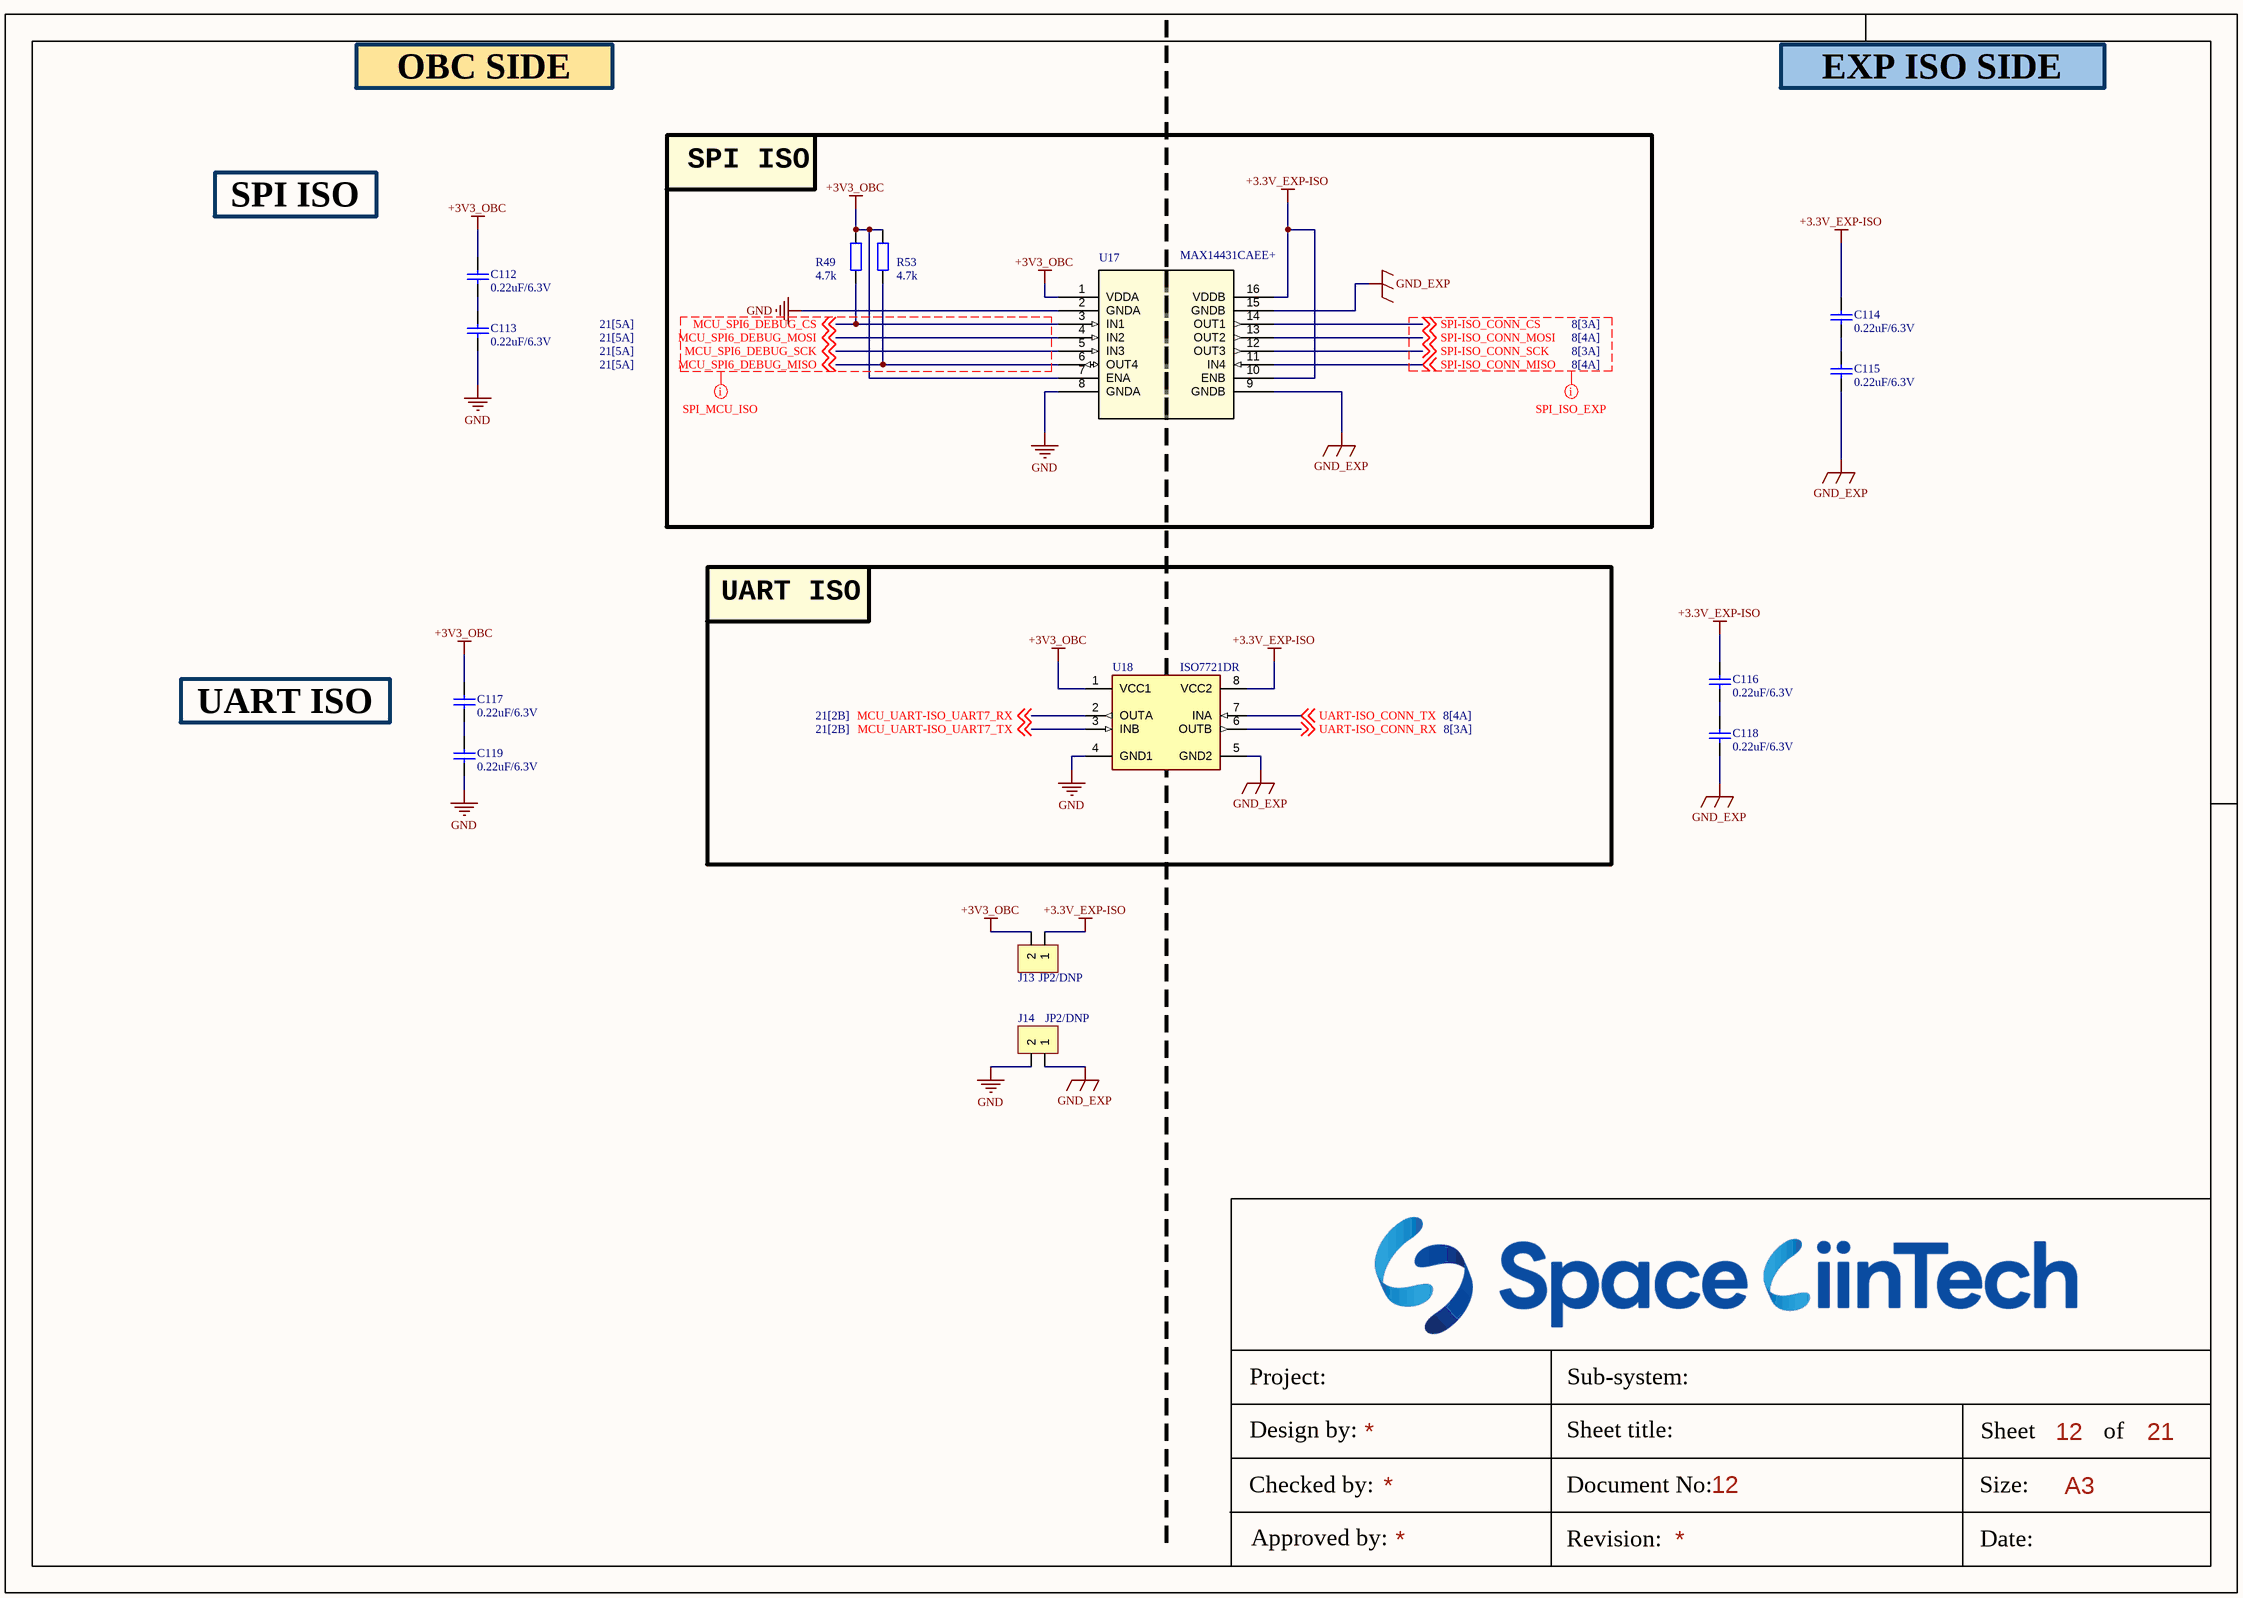
[diagram p5: obc-v2_EXP-CAN-RS422.SchDoc]

### Parts
C112  0.22uF/6.3V  [CAP_C_1005X60]
C113  0.22uF/6.3V  [CAP_C_1005X60]
C114  0.22uF/6.3V  [CAP_C_1005X60]
C115  0.22uF/6.3V  [CAP_C_1005X60]
C116  0.22uF/6.3V  [CAP_C_1005X60]
C117  0.22uF/6.3V  [CAP_C_1005X60]
C118  0.22uF/6.3V  [CAP_C_1005X60]
C119  0.22uF/6.3V  [CAP_C_1005X60]
J13  JP2/DNP  [JP2-D1T]
J14  JP2/DNP  [JP2-D1T]
R49  4.7k  [RES_C_1608X60]
R53  4.7k  [RES_C_1608X60]
U17  MAX14431CAEE+  [21-0055Q_E16MS+1F_MXM]
U18  ISO7721DR  [SOIC127P602X173-8N]

### Blocks framed on the sheet
SPI ISO: R49 R53 U17
UART ISO: U18

### Nets
+3.3V_EXP-ISO: C114.2 C116.2 J13.1 U17.10(ENB) U17.16(VDDB) U18.8(VCC2)
+3V3_OBC: C112.1 C117.1 J13.2 R49.2 R53.2 U17.1(VDDA) U17.7(ENA) U18.1(VCC1)
GND: C113.2 C119.2 J14.2 U17.2(GNDA) U17.8(GNDA) U18.4(GND1)
GND_EXP: C115.1 C118.1 J14.1 U17.9(GNDB) U17.15(GNDB) U18.5(GND2)
MCU_SPI6_DEBUG_CS: R49.1 U17.3(IN1) ; off-sheet MCU_SPI6_DEBUG_CS
MCU_SPI6_DEBUG_MISO: R53.1 U17.6(OUT4) ; off-sheet MCU_SPI6_DEBUG_MISO
MCU_SPI6_DEBUG_MOSI: U17.4(IN2) ; off-sheet MCU_SPI6_DEBUG_MOSI
MCU_SPI6_DEBUG_SCK: U17.5(IN3) ; off-sheet MCU_SPI6_DEBUG_SCK
MCU_UART-ISO_UART7_RX: U18.2(OUTA) ; off-sheet MCU_UART-ISO_UART7_RX
MCU_UART-ISO_UART7_TX: U18.3(INB) ; off-sheet MCU_UART-ISO_UART7_TX
SPI-ISO_CONN_CS: U17.14(OUT1) ; off-sheet SPI-ISO_CONN_CS
SPI-ISO_CONN_MISO: U17.11(IN4) ; off-sheet SPI-ISO_CONN_MISO
SPI-ISO_CONN_MOSI: U17.13(OUT2) ; off-sheet SPI-ISO_CONN_MOSI
SPI-ISO_CONN_SCK: U17.12(OUT3) ; off-sheet SPI-ISO_CONN_SCK
UART-ISO_CONN_RX: U18.6(OUTB) ; off-sheet UART-ISO_CONN_RX
UART-ISO_CONN_TX: U18.7(INA) ; off-sheet UART-ISO_CONN_TX
NetC112_2: C112.2 C113.1
NetC114_1: C114.1 C115.2
NetC116_1: C116.1 C118.2
NetC117_2: C117.2 C119.1

### Layout directives
net class SPI_MCU_ISO: MCU_SPI6_DEBUG_CS, MCU_SPI6_DEBUG_MISO, MCU_SPI6_DEBUG_MOSI, MCU_SPI6_DEBUG_SCK
net class SPI_ISO_EXP: SPI-ISO_CONN_CS, SPI-ISO_CONN_MISO, SPI-ISO_CONN_MOSI, SPI-ISO_CONN_SCK

### Notes on the sheet
- OBC SIDE
- EXP ISO SIDE
- SPI ISO
- UART ISO
- Project:
- Sub-system:
- Design by:
- Sheet title:
- Sheet
- A3
- of
- Checked by:
- Approved by:
- Revision:
- Document No:
- Size:
- Date:

### Library data of the parts
C112-C119 = Tu 0402 33nF 10V: as C1 on sheet obc-v2_POWER; Kieu_Chan: *
J13 J14 = JP2: WR-PHD 2.54 mm Angled Socket Header; Manufacturer: W¨¹rth Elektronik eiSos GmbH; partNo: 613002143121; ComponentLink1 Description: Manufacturer; ComponentLink2 Description: Datasheet; NoPins: 02; Created Date: 29 March 2013; ComponentLink1URL: http://www.we-online.com; ComponentLink2URL: http://katalog.we-online.de/em/datasheet/6130xx143121.pdf; Created by: Karrer Zheng
R49 R53 = Tro 0603 1% 10k: as R1 on sheet obc-v2_POWER; Kieu_Chan: *
U17 = MAX14431CAEE+: No Description Available; Mfr_Name: Analog Devices / Maxim Integrated; RefDes: RefDes; Type: Type
U18 = ISO7721DR: Robust EMC, dual-channel, 1/1, reinforced digital isolator 8-SOIC -55 to 125; Package: None; Value: *; MP: ISO7721DR; Availability: Unavailable; Price: None

## Sheet obc-v2_CM4-M2.SchDoc
size 420 x 297 mm; SheetNumber: 13; SheetTotal: 21
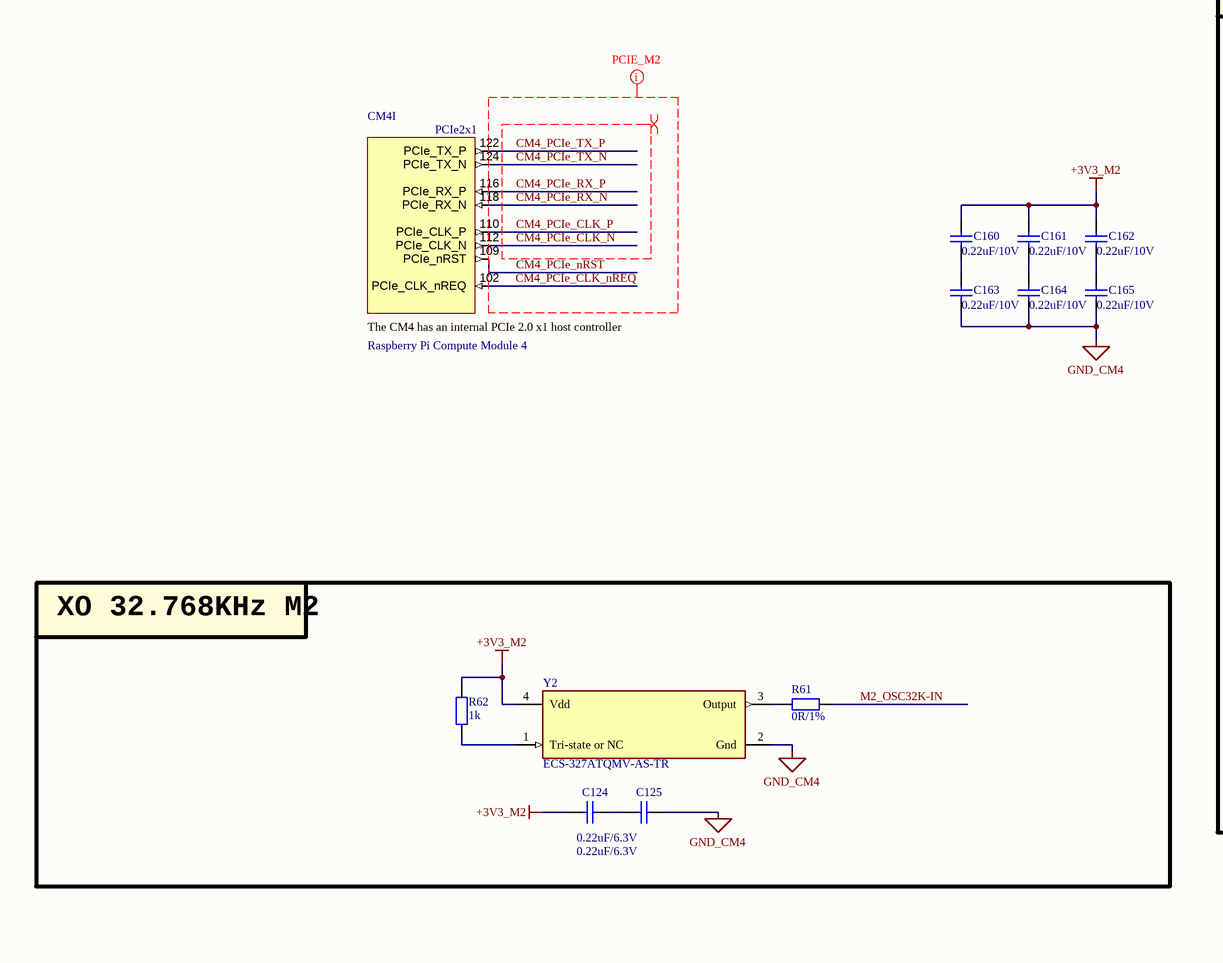
[diagram p6: obc-v2_CM4-M2.SchDoc, left]
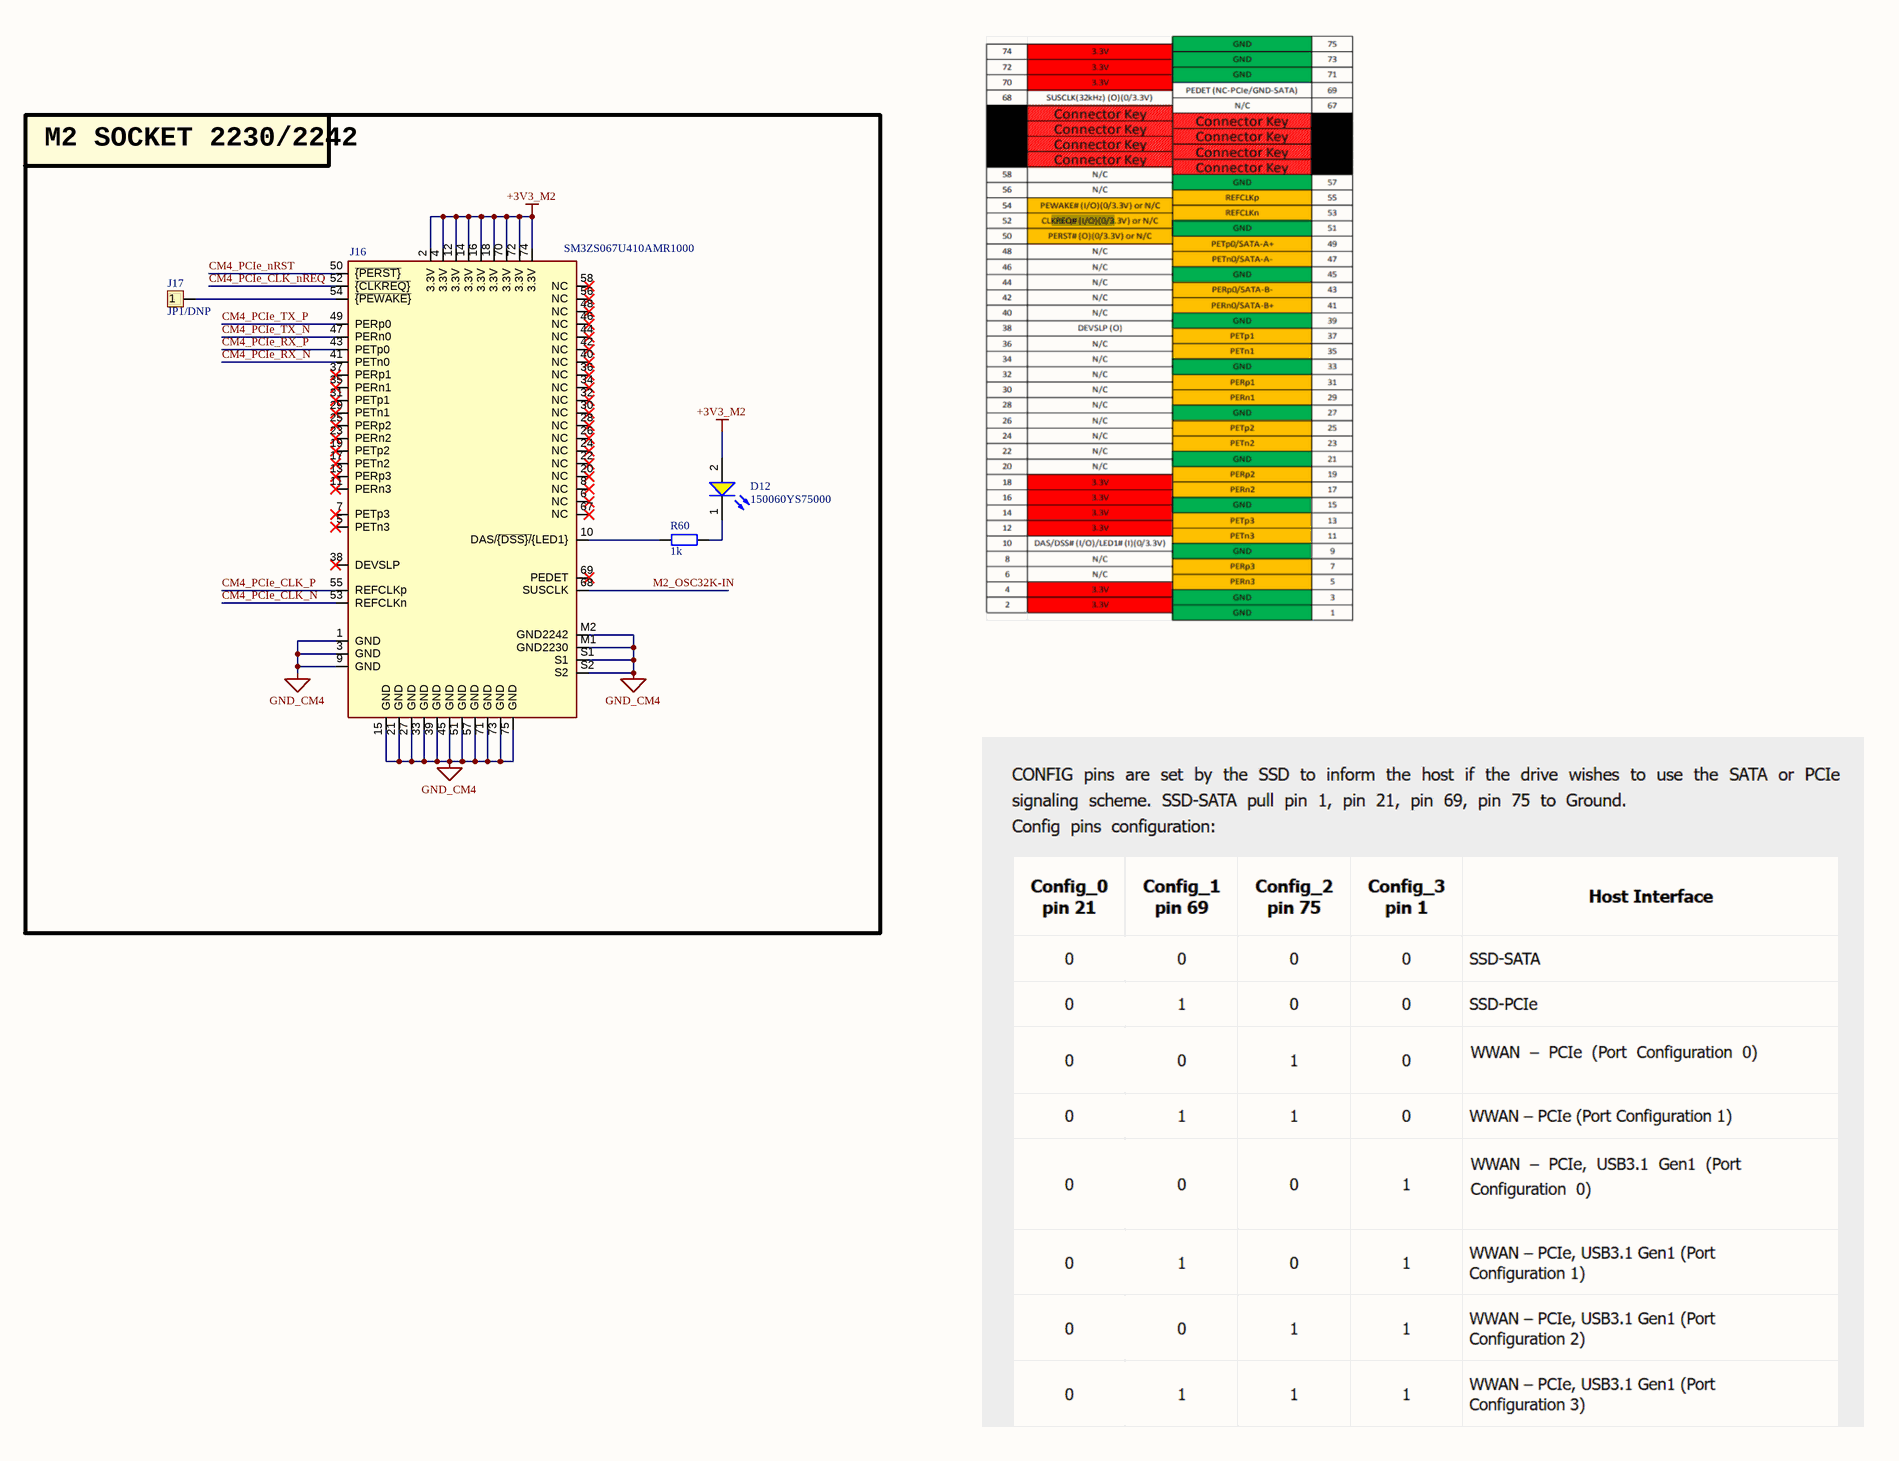
[diagram p7: obc-v2_CM4-M2.SchDoc, right]

### Parts
C124  0.22uF/6.3V  [CAP_C_1005X60]
C125  0.22uF/6.3V  [CAP_C_1005X60]
C160  0.22uF/10V  [CAP_C_1005X60]
C161  0.22uF/10V  [CAP_C_1005X60]
C162  0.22uF/10V  [CAP_C_1005X60]
C163  0.22uF/10V  [CAP_C_1005X60]
C164  0.22uF/10V  [CAP_C_1005X60]
C165  0.22uF/10V  [CAP_C_1005X60]
CM4  Raspberry Pi Compute Module 4  [CM4-DF40HC(3.0)-100DS-0.4v_3mm_1.5mm]  (part I of 21)  (no BOM)
D12  150060YS75000  [WL-SMCW_0603_150060xx75000]
J16  value SM3ZS067U410AMR1000  [M.2 M Key socket]  (hidden comment: Bus_M.2_Socket_M)
J17  JP1/DNP  [JP1-D1T]
R60  1k  [RES_C_1608X60]
R61  0R/1%  [RES_C_1608X60]
R62  1k  [RES_C_1608X60]
Y2  ECS-327ATQMV-AS-TR  [FP-327ATQMV-MFG]

### Blocks framed on the sheet
M2 SOCKET 2230/2242: D12 J16 J17 R60
XO 32.768KHz M2: C124 C125 R61 R62 Y2

### Nets
+3V3_M2: C124.1 C160.1 C161.1 C162.1 D12.2(A) J16.2(3.3V) J16.4(3.3V) J16.12(3.3V) J16.14(3.3V) J16.16(3.3V) J16.18(3.3V) J16.70(3.3V) J16.72(3.3V) J16.74(3.3V) R62.1 Y2.4(Vdd)
GND_CM4: C125.2 C163.2 C164.2 C165.2 J16.1(GND) J16.3(GND) J16.9(GND) J16.15(GND) J16.21(GND) J16.27(GND) J16.33(GND) J16.39(GND) J16.45(GND) J16.51(GND) J16.57(GND) J16.71(GND) J16.73(GND) J16.75(GND) J16.M1(GND2230) J16.M2(GND2242) J16.S1 J16.S2 Y2.2(Gnd)
CM4_PCIe_CLK_N: CM4.112(PCIe_CLK_N) J16.53(REFCLKn)
CM4_PCIe_CLK_nREQ: CM4.102(PCIe_CLK_nREQ) J16.52(~{{CLKREQ}})
CM4_PCIe_CLK_P: CM4.110(PCIe_CLK_P) J16.55(REFCLKp)
CM4_PCIe_nRST: CM4.109(PCIe_nRST) J16.50(~{{PERST}})
CM4_PCIe_RX_N: CM4.118(PCIe_RX_N) J16.41(PETn0)
CM4_PCIe_RX_P: CM4.116(PCIe_RX_P) J16.43(PETp0)
CM4_PCIe_TX_N: CM4.124(PCIe_TX_N) J16.47(PERn0)
CM4_PCIe_TX_P: CM4.122(PCIe_TX_P) J16.49(PERp0)
M2_OSC32K-IN: J16.68(SUSCLK) R61.1
NetC124_2: C124.2 C125.1
NetC160_2: C160.2 C163.1
NetC161_2: C161.2 C164.1
NetC162_2: C162.2 C165.1
NetD12_1: D12.1(K) R60.1
NetJ16_10: J16.10(DAS/~{{DSS}/}{LED1}) R60.2
NetJ16_54: J16.54(~{{PEWAKE}}) J17.1
NetR61_2: R61.2 Y2.3(Output)
NetR62_2: R62.2 Y2.1(Tri-state_or_NC)

Not connected (* = marked no-connect by the designer): J16 5(PETn3)* 6(NC)* 7(PETp3)* 8(NC)* 11(PERn3)* 13(PERp3)* 17(PETn2)* 19(PETp2)* 20(NC)* 22(NC)* 23(PERn2)* 24(NC)* 25(PERp2)* 26(NC)* 28(NC)* 29(PETn1)* 30(NC)* 31(PETp1)* 32(NC)* 34(NC)* 35(PERn1)* 36(NC)* 37(PERp1)* 38(DEVSLP)* 40(NC)* 42(NC)* 44(NC)* 46(NC)* 48(NC)* 56(NC)* 58(NC)* 67(NC)* 69(PEDET)*

### Layout directives
differential pair; differential pair class DIFF100: CM4_PCIe_CLK_N, CM4_PCIe_CLK_P, CM4_PCIe_RX_N, CM4_PCIe_RX_P, CM4_PCIe_TX_N, CM4_PCIe_TX_P
net class PCIE_M2: CM4_PCIe_CLK_N, CM4_PCIe_CLK_nREQ, CM4_PCIe_CLK_P, CM4_PCIe_nRST, CM4_PCIe_RX_N, CM4_PCIe_RX_P, CM4_PCIe_TX_N, CM4_PCIe_TX_P

### Notes on the sheet
- Project:
- Sub-system:
- Design by:
- Sheet title:
- Sheet
- A3
- of
- Checked by:
- Approved by:
- Revision:
- Document No:
- Size:
- Date:
- (in symbol CM4, part I) PCIe2x1; The CM4 has an internal PCIe 2.0 x1 host controller

### Library data of the parts
C124 C125 C160-C165 = Tu 0402 33nF 10V: as C1 on sheet obc-v2_POWER; Kieu_Chan: *
CM4 = CM4: Raspberry Pi Compute Module 4 by Amornthep Phunsin
D12 = CMP-1426-00005-2: as D1 on sheet obc-v2_POWER; Case Code (Imperial): 0603; Height: 700µm; REACH SVHC: Unknown; Dominant Wavelength: 590nm; Min Operating Temperature: -40°C; Color: Yellow; Width: 800µm; Mount: Surface Mount; Packaging: Tape and Reel; Max Operating Temperature: 85°C; RoHS: Compliant; Max Reverse Voltage (DC): 5V; Case Code (Metric): 1608; Length: 1.6mm; Case/Package: 0603
J16 = Bus_M.2_Socket_M: Part Description: M.2 M Key connector; Field5: MTSSD03-67MSW337; Field7: MTCONN; Field6: MTSSD03-67MSW337; Footprint: CM5IO:M.2 M Key socket
J17 = JP1: as J2 on sheet obc-v2_RTC-WDOG; Created Date: 29 March 2013; ComponentLink1URL: http://www.we-online.com; ComponentLink2URL: http://katalog.we-online.de/em/datasheet/6130xx143121.pdf; Created by: Karrer Zheng
R60-R62 = Tro 0603 1% 10k: as R1 on sheet obc-v2_POWER; Kieu_Chan: *
Y2 = CMP-40224-000027-1: XTAL OSC XO 32.7680KHZ CMOS SMD; RoHS Compliant: Yes

## Sheet obc-v2_CM4-PinOut.SchDoc
size 420 x 297 mm; SheetNumber: 14; SheetTotal: 21
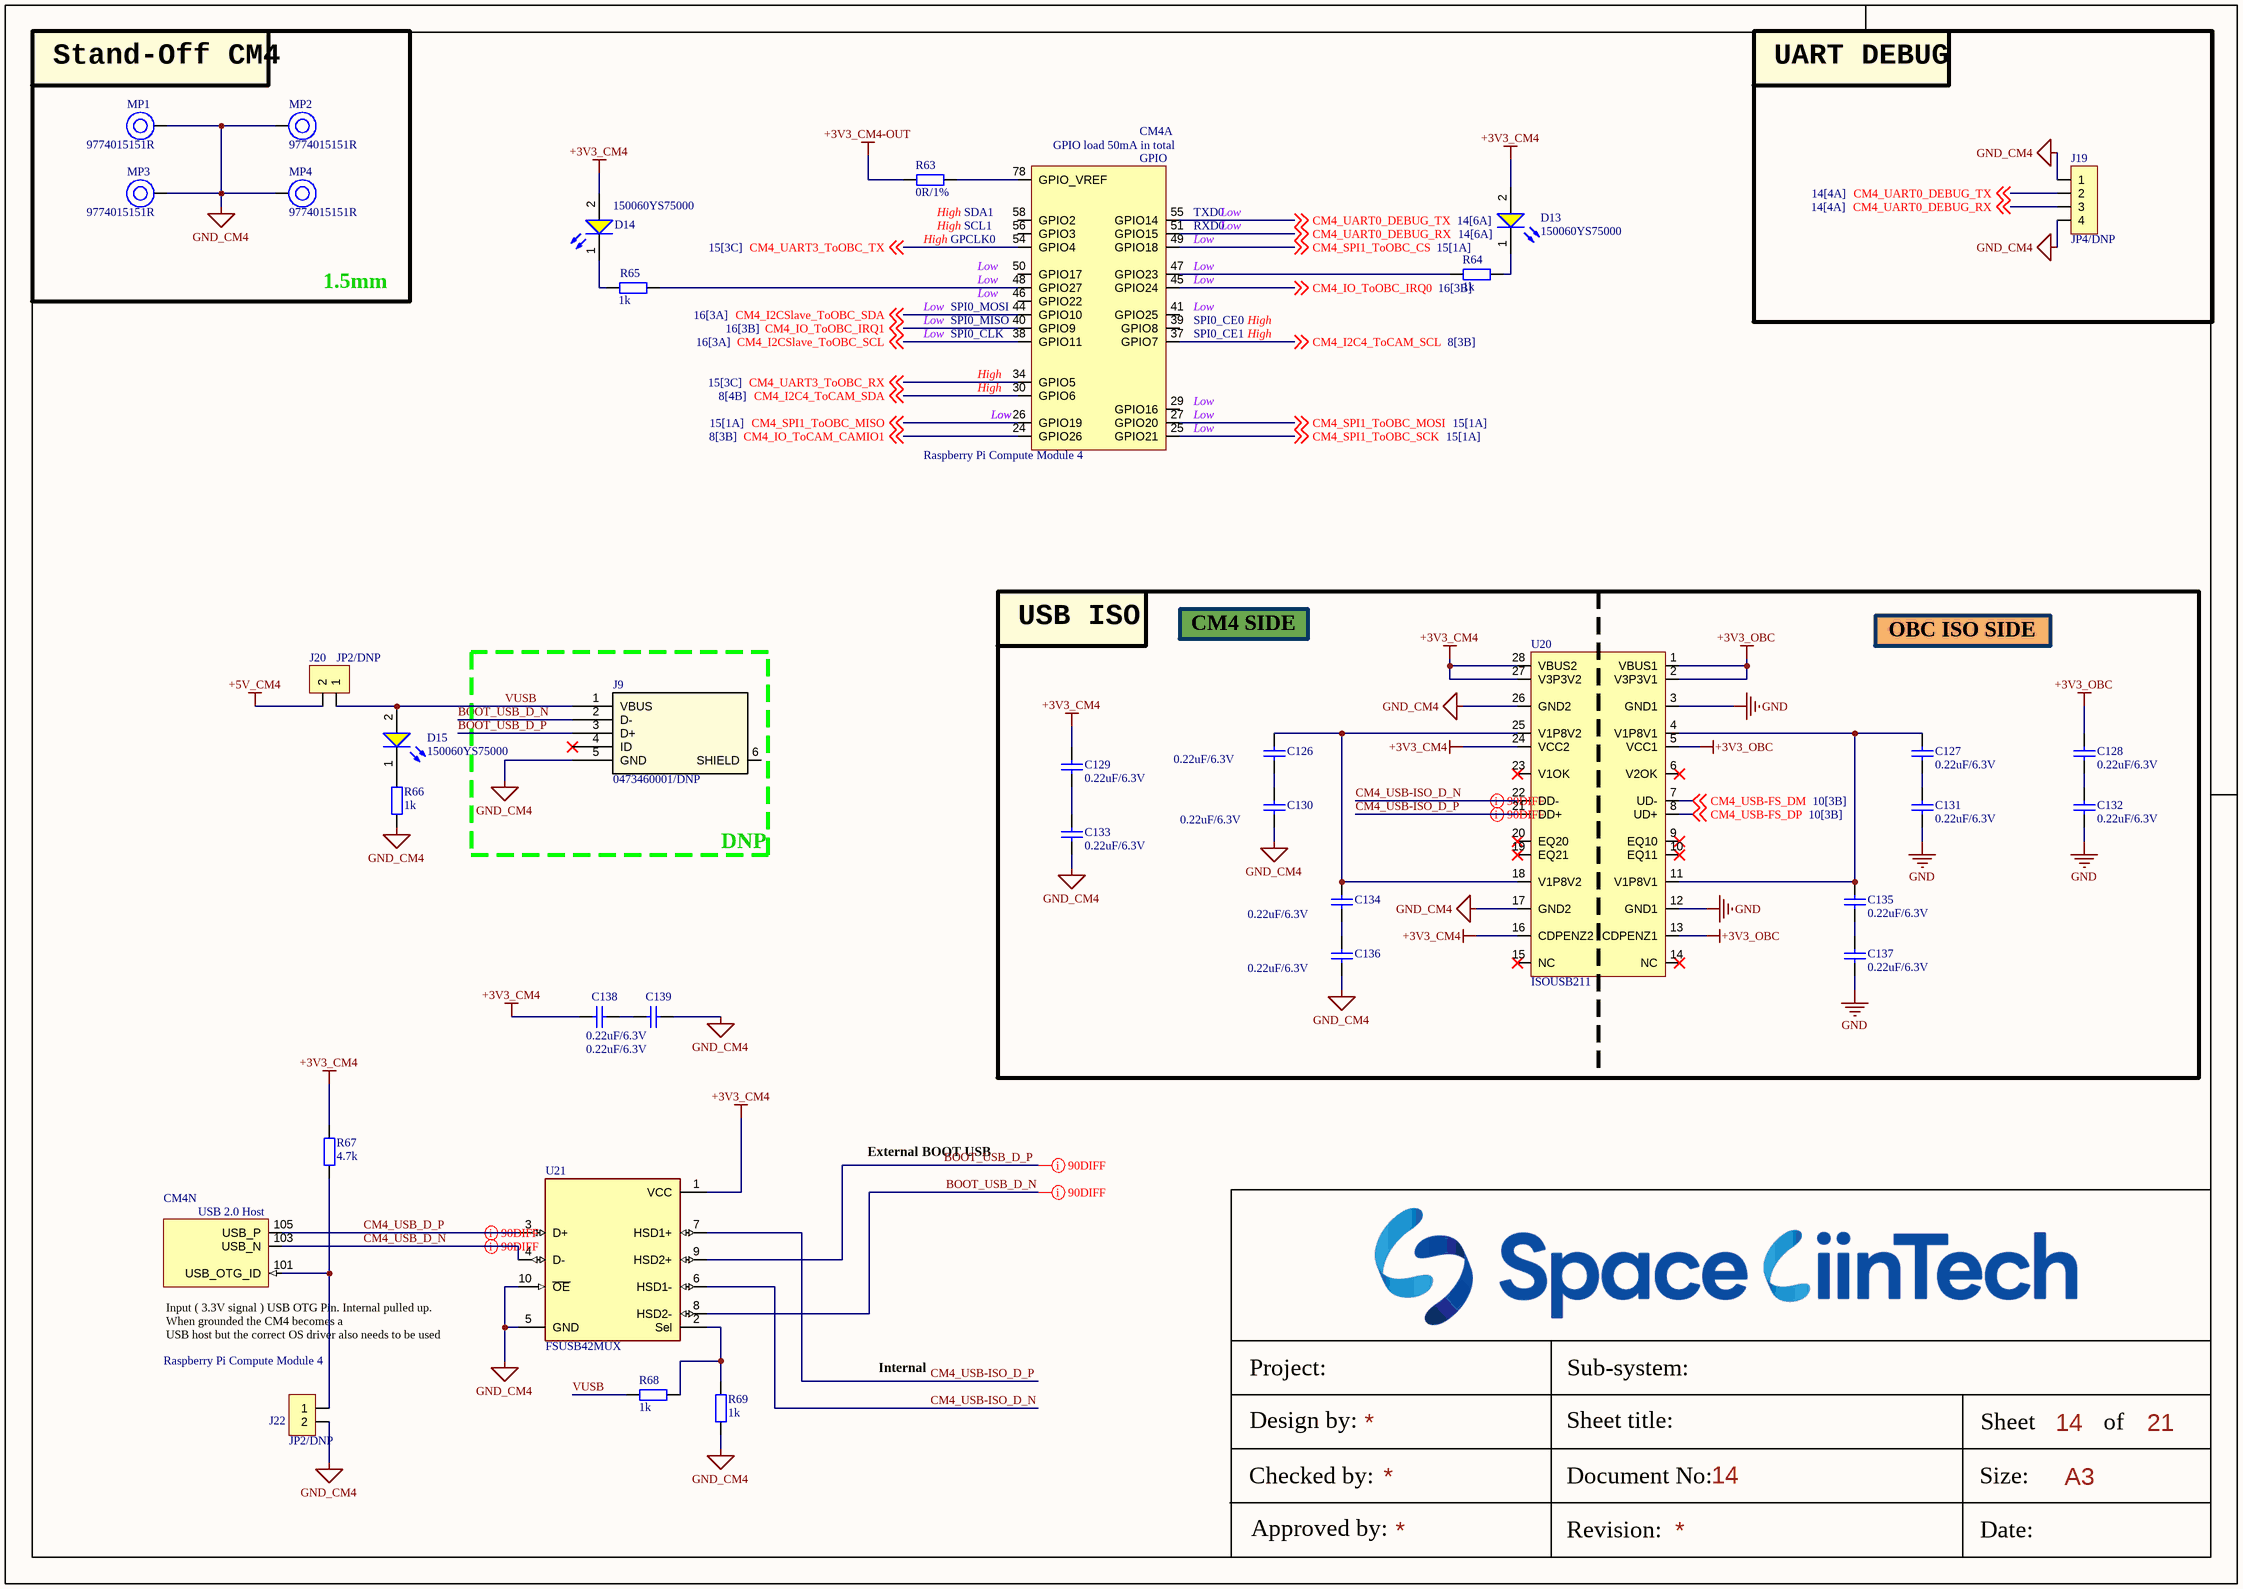
[diagram p8: obc-v2_CM4-PinOut.SchDoc]

### Parts
C126  0.22uF/6.3V  [CAP_C_1005X60]
C127  0.22uF/6.3V  [CAP_C_1005X60]
C128  0.22uF/6.3V  [CAP_C_1005X60]
C129  0.22uF/6.3V  [CAP_C_1005X60]
C130  0.22uF/6.3V  [CAP_C_1005X60]
C131  0.22uF/6.3V  [CAP_C_1005X60]
C132  0.22uF/6.3V  [CAP_C_1005X60]
C133  0.22uF/6.3V  [CAP_C_1005X60]
C134  0.22uF/6.3V  [CAP_C_1005X60]
C135  0.22uF/6.3V  [CAP_C_1005X60]
C136  0.22uF/6.3V  [CAP_C_1005X60]
C137  0.22uF/6.3V  [CAP_C_1005X60]
C138  0.22uF/6.3V  [CAP_C_1005X60]
C139  0.22uF/6.3V  [CAP_C_1005X60]
CM4  Raspberry Pi Compute Module 4  [CM4-DF40HC(3.0)-100DS-0.4v_3mm_1.5mm]  (parts A,N of 21)  (no BOM)
D13  150060YS75000  [WL-SMCW_0603_150060xx75000]
D14  150060YS75000  [WL-SMCW_0603_150060xx75000]
D15  150060YS75000  [WL-SMCW_0603_150060xx75000]
J9  0473460001/DNP  [47346-0001_MOL]
J19  JP4/DNP  [JP4-C1T]
J20  JP2/DNP  [JP2-D1T]
J22  JP2/DNP  [JP2-D1T]
MP1  9774015151R  [9774015151]
MP2  9774015151R  [9774015151]
MP3  9774015151R  [9774015151]
MP4  9774015151R  [9774015151]
R63  0R/1%  [RES_C_1608X60]
R64  1k  [RES_C_1608X60]
R65  1k  [RES_C_1608X60]
R66  1k  [RES_C_1608X60]
R67  4.7k  [RES_C_1608X60]
R68  1k  [RES_C_1608X60]
R69  1k  [RES_C_1608X60]
U20  ISOUSB211  [BSSOP_65P_750W_28]
U21  FSUSB42MUX  [FP-846AP-MFG]

### Blocks framed on the sheet
Stand-Off CM4: MP1-MP4
UART DEBUG: J19
USB ISO: C126-C137 U20
DNP: J9

### Nets
+3V3_CM4: C129.1 C138.1 D13.2(A) D14.2(A) R67.1 U20.16(CDPENZ2) U20.24(VCC2) U20.27(V3P3V2) U20.28(VBUS2) U21.1(VCC)
+3V3_CM4-OUT: R63.1
+3V3_OBC: C128.1 U20.1(VBUS1) U20.2(V3P3V1) U20.5(VCC1) U20.13(CDPENZ1)
+5V_CM4: J20.2  [project net +5V_AUX-Adaptor]
GND: C131.2 C132.2 C137.2 U20.3(GND1) U20.12(GND1)
GND_CM4: C130.2 C133.2 C136.2 C139.2 J9.5(GND) J19.1 J19.4 J22.2 MP1.1 MP2.1 MP3.1 MP4.1 R66.2 R69.2 U20.17(GND2) U20.26(GND2) U21.5(GND) U21.10(~{OE})
BOOT_USB_D_N: J9.2(D-) U21.8(HSD2-)
BOOT_USB_D_P: J9.3(D+) U21.9(HSD2+)
CM4_I2C4_ToCAM_SCL: CM4.37(GPIO7) ; off-sheet CM4_I2C4_ToCAM_SCL
CM4_I2C4_ToCAM_SDA: CM4.30(GPIO6) ; off-sheet CM4_I2C4_ToCAM_SDA
CM4_I2CSlave_ToOBC_SCL: CM4.38(GPIO11) ; off-sheet CM4_I2CSlave_ToOBC_SCL
CM4_I2CSlave_ToOBC_SDA: CM4.44(GPIO10) ; off-sheet CM4_I2CSlave_ToOBC_SDA
CM4_IO_ToCAM_CAMIO1: CM4.24(GPIO26) ; off-sheet CM4_IO_ToCAM_CAMIO1
CM4_IO_ToOBC_IRQ0: CM4.45(GPIO24) ; off-sheet CM4_IO_ToOBC_IRQ0
CM4_IO_ToOBC_IRQ1: CM4.40(GPIO9) ; off-sheet CM4_IO_ToOBC_IRQ1
CM4_SPI1_ToOBC_CS: CM4.49(GPIO18) ; off-sheet CM4_SPI1_ToOBC_CS  [project net CM4_SPI1_ISO_CS]
CM4_SPI1_ToOBC_MISO: CM4.26(GPIO19) ; off-sheet CM4_SPI1_ToOBC_MISO  [project net CM4_SPI1_ISO_MISO]
CM4_SPI1_ToOBC_MOSI: CM4.27(GPIO20) ; off-sheet CM4_SPI1_ToOBC_MOSI  [project net CM4_SPI1_ISO_MOSI]
CM4_SPI1_ToOBC_SCK: CM4.25(GPIO21) ; off-sheet CM4_SPI1_ToOBC_SCK  [project net CM4_SPI1_ISO_SCK]
CM4_UART0_DEBUG_RX: CM4.51(GPIO15) J19.3 ; off-sheet CM4_UART0_DEBUG_RX
CM4_UART0_DEBUG_TX: CM4.55(GPIO14) J19.2 ; off-sheet CM4_UART0_DEBUG_TX
CM4_UART3_ToOBC_RX: CM4.34(GPIO5) ; off-sheet CM4_UART3_ToOBC_RX
CM4_UART3_ToOBC_TX: CM4.54(GPIO4) ; off-sheet CM4_UART3_ToOBC_TX
CM4_USB-FS_DM: U20.7(UD-) ; off-sheet CM4_USB-FS_DM
CM4_USB-FS_DP: U20.8(UD+) ; off-sheet CM4_USB-FS_DP
CM4_USB-ISO_D_N: U20.22(DD-) U21.6(HSD1-)
CM4_USB-ISO_D_P: U20.21(DD+) U21.7(HSD1+)
CM4_USB_D_N: CM4.103(USB_N) U21.4(D-)
CM4_USB_D_P: CM4.105(USB_P) U21.3(D+)
VUSB: D15.2(A) J9.1(VBUS) J20.1 R68.1
NetC126_1: C126.1 C134.1 U20.18(V1P8V2) U20.25(V1P8V2)
NetC126_2: C126.2 C130.1
NetC127_1: C127.1 C135.1 U20.4(V1P8V1) U20.11(V1P8V1)
NetC127_2: C127.2 C131.1
NetC128_2: C128.2 C132.1
NetC129_2: C129.2 C133.1
NetC134_2: C134.2 C136.1
NetC135_2: C135.2 C137.1
NetC138_2: C138.2 C139.1
NetCM4_47: CM4.47(GPIO23) R64.2
NetCM4_48: CM4.48(GPIO27) R65.2
NetCM4_78: CM4.78(GPIO_VREF) R63.2
NetCM4_101: CM4.101(USB_OTG_ID) J22.1 R67.2
NetD13_1: D13.1(K) R64.1
NetD14_1: D14.1(K) R65.1
NetD15_1: D15.1(K) R66.1
NetR68_2: R68.2 R69.1 U21.2(Sel)

Not connected (* = marked no-connect by the designer): CM4 29(GPIO16) 39(GPIO8) 41(GPIO25) 46(GPIO22) 50(GPIO17) 56(GPIO3) 58(GPIO2); J9 4(ID)* 6(SHIELD); U20 6(V2OK)* 9(EQ10)* 10(EQ11)* 14(NC)* 15(NC)* 19(EQ21)* 20(EQ20)* 23(V1OK)*

### Layout directives
differential pair; differential pair class DIFF90: BOOT_USB_D_N, BOOT_USB_D_P, CM4_USB-ISO_D_N, CM4_USB-ISO_D_P, CM4_USB_D_N, CM4_USB_D_P

### Notes on the sheet
- 1.5mm
- CM4 SIDE
- OBC ISO SIDE
- External BOOT USB
- Internal
- Project:
- Sub-system:
- Design by:
- Sheet title:
- Sheet
- A3
- of
- Checked by:
- Approved by:
- Revision:
- Document No:
- Size:
- Date:
- (in symbol CM4, part A) GPIO load 50mA in total; GPIO; High; SDA1; TXD0; Low; SCL1; RXD0; GPCLK0; SPI0_MOSI; SPI0_MISO; SPI0_CE0; SPI0_CLK; SPI0_CE1; by Amornthep Phunsin
- (in symbol CM4, part N) USB 2.0 Host; Input ( 3.3V signal ) USB OTG Pin. Internal pulled up. When grounded the CM4 becomes a / USB host but the correct OS driver also needs to be used

### Library data of the parts
C126-C139 = Tu 0402 33nF 10V: as C1 on sheet obc-v2_POWER; Kieu_Chan: *
CM4 = CM4: as CM4 on sheet obc-v2_CM4-M2
D13-D15 = CMP-1426-00005-2: as D1 on sheet obc-v2_POWER; Case Code (Imperial): 0603; Height: 700µm; REACH SVHC: Unknown; Dominant Wavelength: 590nm; Min Operating Temperature: -40°C; Color: Yellow; Width: 800µm; Mount: Surface Mount; Packaging: Tape and Reel; Max Operating Temperature: 85°C; RoHS: Compliant; Max Reverse Voltage (DC): 5V; Case Code (Metric): 1608; Length: 1.6mm; Case/Package: 0603
J9 = USB_micro: as J4 on sheet obc-v2_BOARD-CONNECT; RefDes: RefDes; Type: Type
J19 = JP4: as J8 on sheet obc-v2_DEBUG; Created Date: 29 March 2013; ComponentLink1URL: http://www.we-online.com; ComponentLink2URL: http://katalog.we-online.de/em/datasheet/6130xx143121.pdf; Created by: Karrer Zheng
J20 J22 = JP2: as J13 on sheet obc-v2_EXP-CAN-RS422; Created Date: 29 March 2013; ComponentLink1URL: http://www.we-online.com; ComponentLink2URL: http://katalog.we-online.de/em/datasheet/6130xx143121.pdf; Created by: Karrer Zheng
MP1-MP4 = CMP-03913-59774846-1: 9774015151R WA-SMSI SMT Steel Spacer, M2.5 Internal non Stop; Plating: Tin; Outside Diameter: 5.1054mm; Threaded/Unthreaded: Threaded; Length: 1.5mm; Packaging: Tape and Reel; NexarPartId: 59774846; Min Operating Temperature: -55°C; Height: 1.6mm; Material: Steel; REACH SVHC: Unknown; Max Operating Temperature: 150°C; RoHS: Compliant
R63-R69 = Tro 0603 1% 10k: as R1 on sheet obc-v2_POWER; Kieu_Chan: *
U21 = CMP-07103-000004-1: IC USB SWITCH DPDT 10MSOP; Voltage: 4.3V; Current: 100mA; Number of Inputs: 2; Supply Type: Single; Number of Outputs: 4; Data Rate: 480Mbps; On-State Resistance: 6.5R; Min Supply Voltage: 3V; Package Quantity: 1; Length: 3mm; Radiation Hardening: No; Number of Pins: 10; Width: 3mm; Number of Channels: 2; REACH SVHC: No SVHC; Lead Free: Lead Free; Max Operating Temperature: 85°C; Min Operating Temperature: -40°C; Packaging: Tape and Reel; Throw Configuration: DPDT; Operating Supply Voltage: 4.3V; Max Supply Voltage: 4.3V; Mount: Surface Mount; Case/Package: MSOP; Weight: 0.1125g; Height: 0.85mm

## Sheet obc-v2_CM4-SPI-UART.SchDoc
size 420 x 297 mm; SheetNumber: 15; SheetTotal: 21
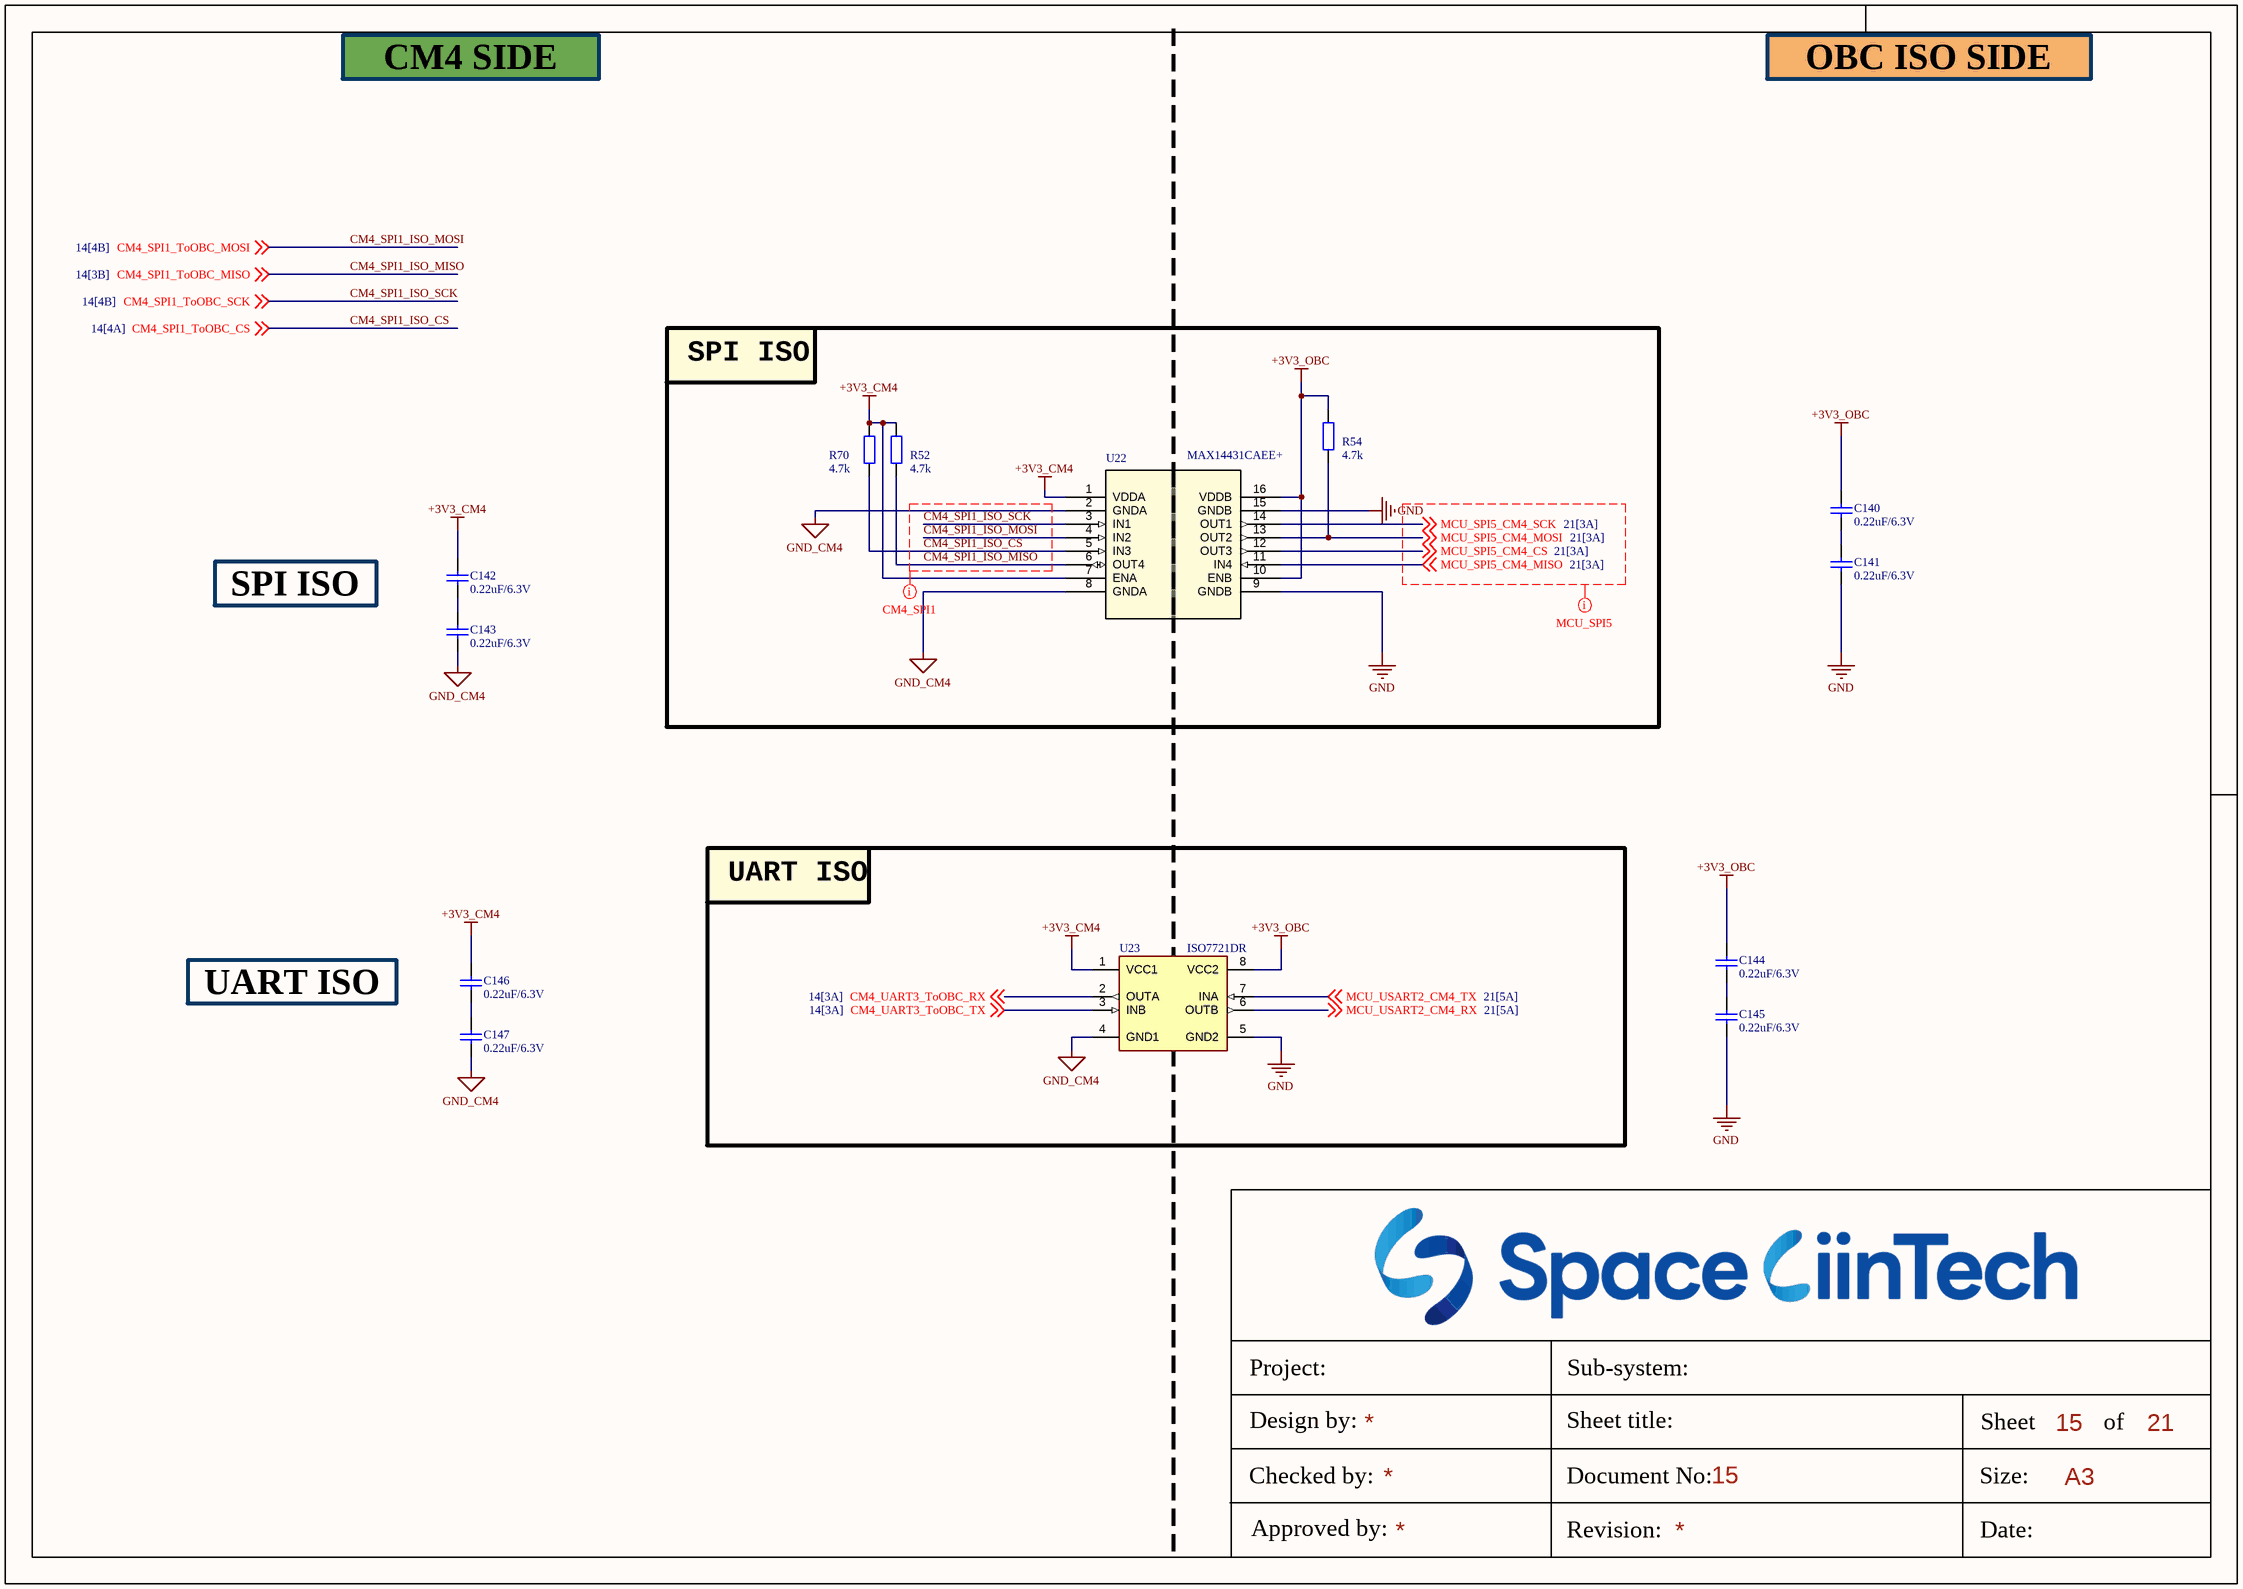
[diagram p9: obc-v2_CM4-SPI-UART.SchDoc]

### Parts
C140  0.22uF/6.3V  [CAP_C_1005X60]
C141  0.22uF/6.3V  [CAP_C_1005X60]
C142  0.22uF/6.3V  [CAP_C_1005X60]
C143  0.22uF/6.3V  [CAP_C_1005X60]
C144  0.22uF/6.3V  [CAP_C_1005X60]
C145  0.22uF/6.3V  [CAP_C_1005X60]
C146  0.22uF/6.3V  [CAP_C_1005X60]
C147  0.22uF/6.3V  [CAP_C_1005X60]
R52  4.7k  [RES_C_1608X60]
R54  4.7k  [RES_C_1608X60]
R70  4.7k  [RES_C_1608X60]
U22  MAX14431CAEE+  [21-0055Q_E16MS+1F_MXM]
U23  ISO7721DR  [SOIC127P602X173-8N]

### Blocks framed on the sheet
SPI ISO: R52 R54 R70 U22
UART ISO: U23

### Nets
+3V3_CM4: C142.1 C146.1 R52.2 R70.2 U22.1(VDDA) U22.7(ENA) U23.1(VCC1)
+3V3_OBC: C140.2 C144.2 R54.2 U22.10(ENB) U22.16(VDDB) U23.8(VCC2)
GND: C141.1 C145.1 U22.9(GNDB) U22.15(GNDB) U23.5(GND2)
GND_CM4: C143.2 C147.2 U22.2(GNDA) U22.8(GNDA) U23.4(GND1)
CM4_SPI1_ISO_CS: R70.1 U22.5(IN3) ; off-sheet CM4_SPI1_ToOBC_CS  [also labelled CM4_SPI1_ToOBC_CS]
CM4_SPI1_ISO_MISO: R52.1 U22.6(OUT4) ; off-sheet CM4_SPI1_ToOBC_MISO  [also labelled CM4_SPI1_ToOBC_MISO]
CM4_SPI1_ISO_MOSI: U22.4(IN2) ; off-sheet CM4_SPI1_ToOBC_MOSI  [also labelled CM4_SPI1_ToOBC_MOSI]
CM4_SPI1_ISO_SCK: U22.3(IN1) ; off-sheet CM4_SPI1_ToOBC_SCK  [also labelled CM4_SPI1_ToOBC_SCK]
CM4_UART3_ToOBC_RX: U23.2(OUTA) ; off-sheet CM4_UART3_ToOBC_RX
CM4_UART3_ToOBC_TX: U23.3(INB) ; off-sheet CM4_UART3_ToOBC_TX
MCU_SPI5_CM4_CS: U22.12(OUT3) ; off-sheet MCU_SPI5_CM4_CS
MCU_SPI5_CM4_MISO: U22.11(IN4) ; off-sheet MCU_SPI5_CM4_MISO
MCU_SPI5_CM4_MOSI: R54.1 U22.13(OUT2) ; off-sheet MCU_SPI5_CM4_MOSI
MCU_SPI5_CM4_SCK: U22.14(OUT1) ; off-sheet MCU_SPI5_CM4_SCK
MCU_USART2_CM4_RX: U23.6(OUTB) ; off-sheet MCU_USART2_CM4_RX
MCU_USART2_CM4_TX: U23.7(INA) ; off-sheet MCU_USART2_CM4_TX
NetC140_1: C140.1 C141.2
NetC142_2: C142.2 C143.1
NetC144_1: C144.1 C145.2
NetC146_2: C146.2 C147.1

### Layout directives
net class SPI1_CM4_STM: CM4_SPI1_ISO_CS, CM4_SPI1_ISO_MISO, CM4_SPI1_ISO_MOSI, CM4_SPI1_ISO_SCK
net class SPI_SMT_CM4: MCU_SPI5_CM4_CS, MCU_SPI5_CM4_MISO, MCU_SPI5_CM4_MOSI, MCU_SPI5_CM4_SCK

### Notes on the sheet
- CM4 SIDE
- OBC ISO SIDE
- SPI ISO
- UART ISO
- Project:
- Sub-system:
- Design by:
- Sheet title:
- Sheet
- A3
- of
- Checked by:
- Approved by:
- Revision:
- Document No:
- Size:
- Date:

### Library data of the parts
C140-C147 = Tu 0402 33nF 10V: as C1 on sheet obc-v2_POWER; Kieu_Chan: *
R52 R54 R70 = Tro 0603 1% 10k: as R1 on sheet obc-v2_POWER; Kieu_Chan: *
U22 = MAX14431CAEE+: as U17 on sheet obc-v2_EXP-CAN-RS422; RefDes: RefDes; Type: Type
U23 = ISO7721DR: as U18 on sheet obc-v2_EXP-CAN-RS422; Package: None; Value: *; MP: ISO7721DR; Availability: Unavailable; Price: None

## Sheet obc-v2_CM4-IRQ-CTRL.SchDoc
size 420 x 297 mm; SheetNumber: 16; SheetTotal: 21
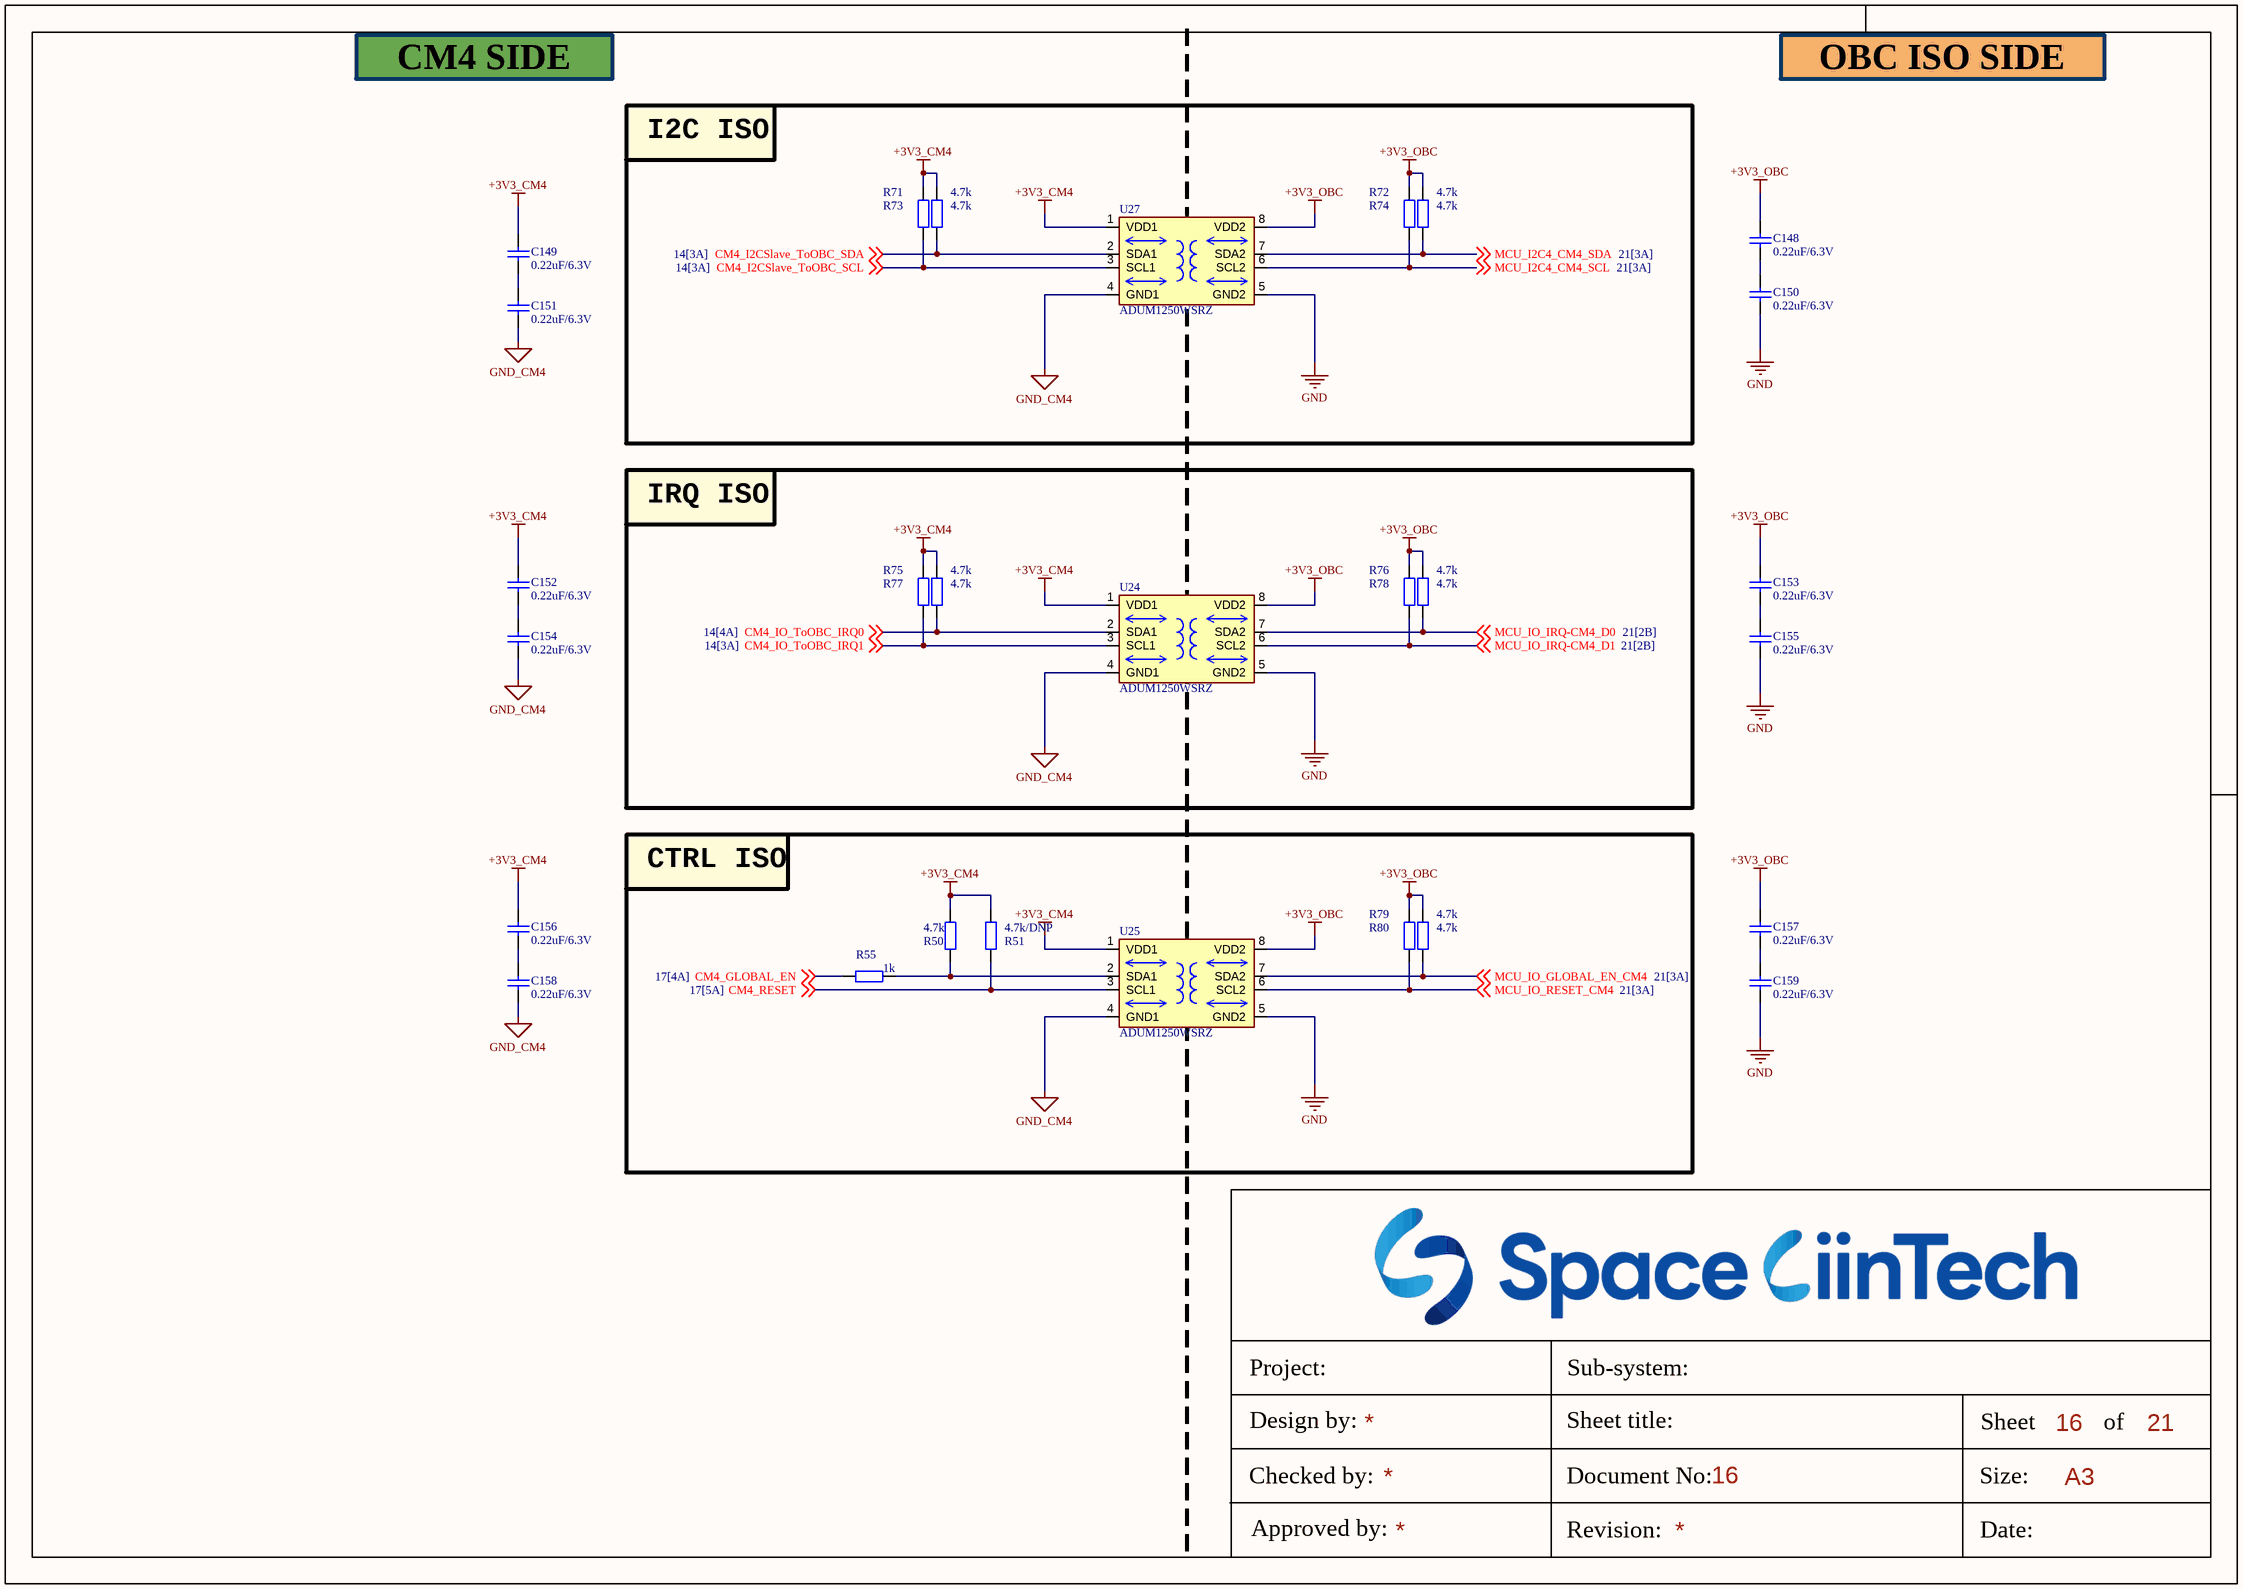
[diagram p10: obc-v2_CM4-IRQ-CTRL.SchDoc]

### Parts
C148  0.22uF/6.3V  [CAP_C_1005X60]
C149  0.22uF/6.3V  [CAP_C_1005X60]
C150  0.22uF/6.3V  [CAP_C_1005X60]
C151  0.22uF/6.3V  [CAP_C_1005X60]
C152  0.22uF/6.3V  [CAP_C_1005X60]
C153  0.22uF/6.3V  [CAP_C_1005X60]
C154  0.22uF/6.3V  [CAP_C_1005X60]
C155  0.22uF/6.3V  [CAP_C_1005X60]
C156  0.22uF/6.3V  [CAP_C_1005X60]
C157  0.22uF/6.3V  [CAP_C_1005X60]
C158  0.22uF/6.3V  [CAP_C_1005X60]
C159  0.22uF/6.3V  [CAP_C_1005X60]
R50  4.7k  [RES_C_1608X60]
R51  4.7k/DNP  [RES_C_1608X60]
R55  1k  [RES_C_1608X60]
R71  4.7k  [RES_C_1608X60]
R72  4.7k  [RES_C_1608X60]
R73  4.7k  [RES_C_1608X60]
R74  4.7k  [RES_C_1608X60]
R75  4.7k  [RES_C_1608X60]
R76  4.7k  [RES_C_1608X60]
R77  4.7k  [RES_C_1608X60]
R78  4.7k  [RES_C_1608X60]
R79  4.7k  [RES_C_1608X60]
R80  4.7k  [RES_C_1608X60]
U24  ADUM1250WSRZ  [SOIC127P602X173-8N]
U25  ADUM1250WSRZ  [SOIC127P602X173-8N]
U27  ADUM1250WSRZ  [SOIC127P602X173-8N]

### Blocks framed on the sheet
I2C ISO: R71-R74 U27
IRQ ISO: R75-R78 U24
CTRL ISO: R50 R51 R55 R79 R80 U25

### Nets
+3V3_CM4: C149.1 C152.1 C156.1 R50.2 R51.2 R71.2 R73.2 R75.2 R77.2 U24.1(VDD1) U25.1(VDD1) U27.1(VDD1)
+3V3_OBC: C148.1 C153.1 C157.1 R72.2 R74.2 R76.2 R78.2 R79.2 R80.2 U24.8(VDD2) U25.8(VDD2) U27.8(VDD2)
GND: C150.2 C155.2 C159.2 U24.5(GND2) U25.5(GND2) U27.5(GND2)
GND_CM4: C151.2 C154.2 C158.2 U24.4(GND1) U25.4(GND1) U27.4(GND1)
CM4_GLOBAL_EN: R55.2 ; off-sheet CM4_GLOBAL_EN  [project net CM4_ENABLE]
CM4_I2CSlave_ToOBC_SCL: R71.1 U27.3(SCL1) ; off-sheet CM4_I2CSlave_ToOBC_SCL
CM4_I2CSlave_ToOBC_SDA: R73.1 U27.2(SDA1) ; off-sheet CM4_I2CSlave_ToOBC_SDA
CM4_IO_ToOBC_IRQ0: R77.1 U24.2(SDA1) ; off-sheet CM4_IO_ToOBC_IRQ0
CM4_IO_ToOBC_IRQ1: R75.1 U24.3(SCL1) ; off-sheet CM4_IO_ToOBC_IRQ1
CM4_RESET: R51.1 U25.3(SCL1) ; off-sheet CM4_RESET
MCU_I2C4_CM4_SCL: R72.1 U27.6(SCL2) ; off-sheet MCU_I2C4_CM4_SCL
MCU_I2C4_CM4_SDA: R74.1 U27.7(SDA2) ; off-sheet MCU_I2C4_CM4_SDA
MCU_IO_GLOBAL_EN_CM4: R80.1 U25.7(SDA2) ; off-sheet MCU_IO_GLOBAL_EN_CM4
MCU_IO_IRQ-CM4_D0: R78.1 U24.7(SDA2) ; off-sheet MCU_IO_IRQ-CM4_D0
MCU_IO_IRQ-CM4_D1: R76.1 U24.6(SCL2) ; off-sheet MCU_IO_IRQ-CM4_D1
MCU_IO_RESET_CM4: R79.1 U25.6(SCL2) ; off-sheet MCU_IO_RESET_CM4
NetC148_2: C148.2 C150.1
NetC149_2: C149.2 C151.1
NetC152_2: C152.2 C154.1
NetC153_2: C153.2 C155.1
NetC156_2: C156.2 C158.1
NetC157_2: C157.2 C159.1
NetR50_1: R50.1 R55.1 U25.2(SDA1)

### Notes on the sheet
- CM4 SIDE
- OBC ISO SIDE
- Project:
- Sub-system:
- Design by:
- Sheet title:
- Sheet
- A3
- of
- Checked by:
- Approved by:
- Revision:
- Document No:
- Size:
- Date:

### Library data of the parts
C148-C159 = Tu 0402 33nF 10V: as C1 on sheet obc-v2_POWER; Kieu_Chan: *
R50 R51 R55 R71-R80 = Tro 0603 1% 10k: as R1 on sheet obc-v2_POWER; Kieu_Chan: *
U24 U25 U27 = ADUM1250: as U15 on sheet obc-v2_EXP-I2C-IRQ; Package: SOIC-8; Price: None; Value: *; SnapEDA_Link: https://www.snapeda.com/parts/ADUM1250/Analog+Devices/view-part/?ref=snap; MP: ADUM1250; Availability: Unavailable; Check_prices: https://www.snapeda.com/parts/ADUM1250/Analog+Devices/view-part/?ref=eda

## Sheet obc-v2_CM4-FUNCTION.SchDoc
size 420 x 297 mm; SheetNumber: 17; SheetTotal: 21
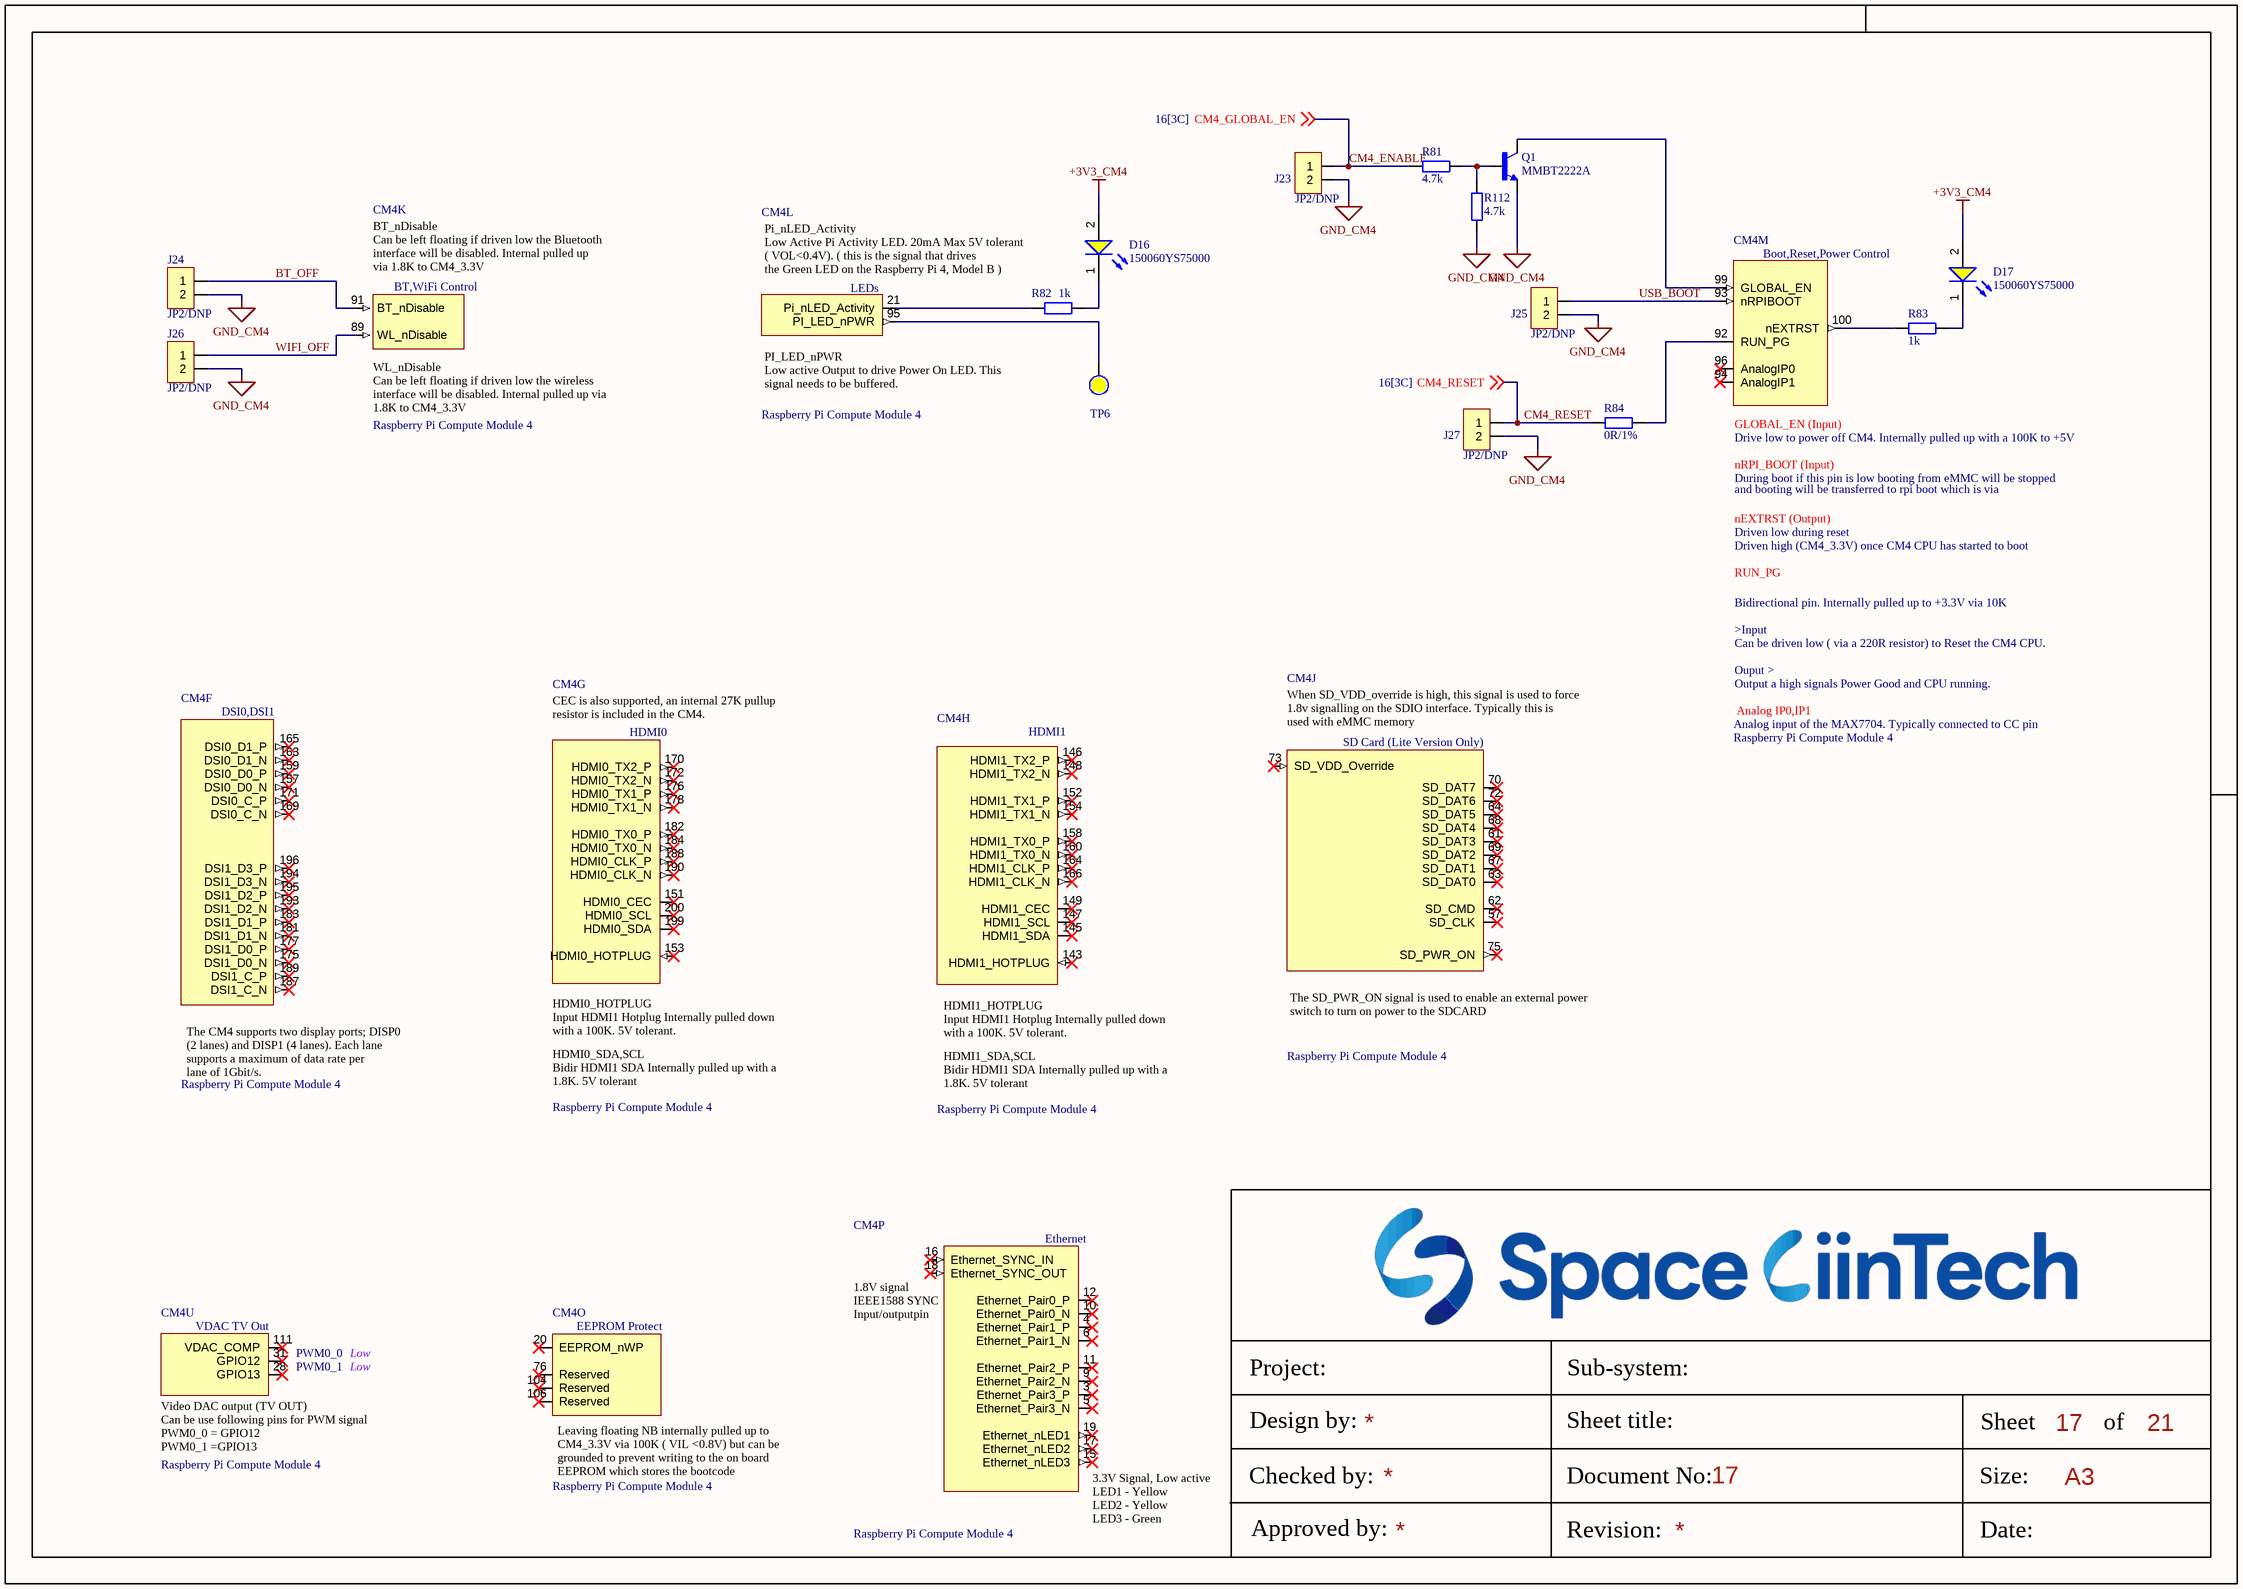
[diagram p11: obc-v2_CM4-FUNCTION.SchDoc]

### Parts
CM4  Raspberry Pi Compute Module 4  [CM4-DF40HC(3.0)-100DS-0.4v_3mm_1.5mm]  (parts F,G,H,J,K,L,M,O,P,U of 21)  (no BOM)
D16  150060YS75000  [WL-SMCW_0603_150060xx75000]
D17  150060YS75000  [WL-SMCW_0603_150060xx75000]
J23  JP2/DNP  [JP2-D1T]
J24  JP2/DNP  [JP2-D1T]
J25  JP2/DNP  [JP2-D1T]
J26  JP2/DNP  [JP2-D1T]
J27  JP2/DNP  [JP2-D1T]
Q1  MMBT2222A  [SOT95P240X120-3N]
R81  4.7k  [RES_C_1608X60]
R82  1k  [RES_C_1608X60]
R83  1k  [RES_C_1608X60]
R84  0R/1%  [RES_C_1608X60]
R112  4.7k  [RES_C_1608X60]
TP6  (no value)  [Test Point 1 Side]  (no BOM)

### Nets
+3V3_CM4: D16.2(A) D17.2(A)
GND_CM4: J23.2 J24.2 J25.2 J26.2 J27.2 Q1.2(E) R112.2
BT_OFF: CM4.91(BT_nDisable) J24.1
CM4_ENABLE: J23.1 R81.2 ; off-sheet CM4_GLOBAL_EN  [also labelled CM4_GLOBAL_EN]
CM4_RESET: J27.1 R84.2 ; off-sheet CM4_RESET
USB_BOOT: CM4.93(nRPIBOOT) J25.1
WIFI_OFF: CM4.89(WL_nDisable) J26.1
NetCM4_21: CM4.21(Pi_nLED_Activity) R82.2
NetCM4_92: CM4.92(RUN_PG) R84.1
NetCM4_95: CM4.95(PI_LED_nPWR) TP6.0
NetCM4_99: CM4.99(GLOBAL_EN) Q1.3(C)
NetCM4_100: CM4.100(nEXTRST) R83.2
NetD16_1: D16.1(K) R82.1
NetD17_1: D17.1(K) R83.1
NetQ1_1: Q1.1(B) R81.1 R112.1

Not connected (* = marked no-connect by the designer): CM4 3(Ethernet_Pair3_P)* 4(Ethernet_Pair1_P)* 5(Ethernet_Pair3_N)* 6(Ethernet_Pair1_N)* 9(Ethernet_Pair2_N)* 10(Ethernet_Pair0_N)* 11(Ethernet_Pair2_P)* 12(Ethernet_Pair0_P)* 15(Ethernet_nLED3)* 16(Ethernet_SYNC_IN)* 17(Ethernet_nLED2)* 18(Ethernet_SYNC_OUT)* 19(Ethernet_nLED1)* 20(EEPROM_nWP)* 28(GPIO13)* 31(GPIO12)* 57(SD_CLK)* 61(SD_DAT3)* 62(SD_CMD)* 63(SD_DAT0)* 64(SD_DAT5)* 67(SD_DAT1)* 68(SD_DAT4)* 69(SD_DAT2)* 70(SD_DAT7)* 72(SD_DAT6)* 73(SD_VDD_Override)* 75(SD_PWR_ON)* 76(Reserved)* 94(AnalogIP1)* 96(AnalogIP0)* 104(Reserved)* 106(Reserved)* 111(VDAC_COMP)* 143(HDMI1_HOTPLUG)* 145(HDMI1_SDA)* 146(HDMI1_TX2_P)* 147(HDMI1_SCL)* 148(HDMI1_TX2_N)* 149(HDMI1_CEC)* 151(HDMI0_CEC)* 152(HDMI1_TX1_P)* 153(HDMI0_HOTPLUG)* 154(HDMI1_TX1_N)* 157(DSI0_D0_N)* 158(HDMI1_TX0_P)* 159(DSI0_D0_P)* 160(HDMI1_TX0_N)* 163(DSI0_D1_N)* 164(HDMI1_CLK_P)* 165(DSI0_D1_P)* 166(HDMI1_CLK_N)* 169(DSI0_C_N)* 170(HDMI0_TX2_P)* 171(DSI0_C_P)* 172(HDMI0_TX2_N)* 175(DSI1_D0_N)* 176(HDMI0_TX1_P)* 177(DSI1_D0_P)* 178(HDMI0_TX1_N)* 181(DSI1_D1_N)* 182(HDMI0_TX0_P)* 183(DSI1_D1_P)* 184(HDMI0_TX0_N)* 187(DSI1_C_N)* 188(HDMI0_CLK_P)* 189(DSI1_C_P)* 190(HDMI0_CLK_N)* 193(DSI1_D2_N)* 194(DSI1_D3_N)* 195(DSI1_D2_P)* 196(DSI1_D3_P)* 199(HDMI0_SDA)* 200(HDMI0_SCL)*

### Notes on the sheet
- Project:
- Sub-system:
- Design by:
- Sheet title:
- Sheet
- A3
- of
- Checked by:
- Approved by:
- Revision:
- Document No:
- Size:
- Date:
- (in symbol CM4, part F) DSI0,DSI1; The CM4 supports two display ports; DISP0 (2 lanes) and DISP1 (4 lanes). Each lane supports a maximum of data rate per / lane of 1Gbit/s.
- (in symbol CM4, part G) HDMI0; CEC is also supported, an internal 27K pullup resistor is included in the CM4.; HDMI0_HOTPLUG / Input HDMI1 Hotplug Internally pulled down with a 100K. 5V tolerant.; HDMI0_SDA,SCL / Bidir HDMI1 SDA Internally pulled up with a 1.8K. 5V tolerant
- (in symbol CM4, part H) HDMI1; HDMI1_HOTPLUG / Input HDMI1 Hotplug Internally pulled down with a 100K. 5V tolerant.; HDMI1_SDA,SCL / Bidir HDMI1 SDA Internally pulled up with a 1.8K. 5V tolerant
- (in symbol CM4, part J) When SD_VDD_override is high, this signal is used to force 1.8v signalling on the SDIO interface. Typically this is / used with eMMC memory; SD Card (Lite Version Only); by Amornthep Phunsin; The SD_PWR_ON signal is used to enable an external power switch to turn on power to the SDCARD
- (in symbol CM4, part K) BT_nDisable / Can be left floating if driven low the Bluetooth interface will be disabled. Internal pulled up / via 1.8K to CM4_3.3V; BT,WiFi Control; WL_nDisable / Can be left floating if driven low the wireless interface will be disabled. Internal pulled up via / 1.8K to CM4_3.3V
- (in symbol CM4, part L) Pi_nLED_Activity / Low Active Pi Activity LED. 20mA Max 5V tolerant ( VOL<0.4V). ( this is the signal that drives / the Green LED on the Raspberry Pi 4, Model B ); LEDs; PI_LED_nPWR / Low active Output to drive Power On LED. This signal needs to be buffered.
- (in symbol CM4, part M) Boot,Reset,Power Control; GLOBAL_EN (Input); Drive low to power off CM4. Internally pulled up with a 100K to +5V; nRPI_BOOT (Input); During boot if this pin is low booting from eMMC will be stopped; and booting will be transferred to rpi boot which is via; nEXTRST (Output); Driven low during reset; Driven high (CM4_3.3V) once CM4 CPU has started to boot; Bidirectional pin. Internally pulled up to +3.3V via 10K / >Input / Can be driven low ( via a 220R resistor) to Reset the CM4 CPU. / Ouput > / Output a high signals Power Good and CPU running.; Analog IP0,IP1; Analog input of the MAX7704. Typically connected to CC pin
- (in symbol CM4, part O) EEPROM Protect; Leaving floating NB internally pulled up to CM4_3.3V via 100K ( VIL <0.8V) but can be / grounded to prevent writing to the on board EEPROM which stores the bootcode
- (in symbol CM4, part P) Ethernet; 1.8V signal / IEEE1588 SYNC Input/outputpin; by Amornthep Phunsin; 3.3V Signal, Low active / LED1 - Yellow / LED2 - Yellow / LED3 - Green
- (in symbol CM4, part U) VDAC TV Out; PWM0_0; Low; PWM0_1; Video DAC output (TV OUT) / Can be use following pins for PWM signal / PWM0_0 = GPIO12 / PWM0_1 =GPIO13

### Library data of the parts
CM4 = CM4: as CM4 on sheet obc-v2_CM4-M2
D16 D17 = CMP-1426-00005-2: as D1 on sheet obc-v2_POWER; Case Code (Imperial): 0603; Height: 700µm; REACH SVHC: Unknown; Dominant Wavelength: 590nm; Min Operating Temperature: -40°C; Color: Yellow; Width: 800µm; Mount: Surface Mount; Packaging: Tape and Reel; Max Operating Temperature: 85°C; RoHS: Compliant; Max Reverse Voltage (DC): 5V; Case Code (Metric): 1608; Length: 1.6mm; Case/Package: 0603
J23-J27 = JP2: as J13 on sheet obc-v2_EXP-CAN-RS422; Created Date: 29 March 2013; ComponentLink1URL: http://www.we-online.com; ComponentLink2URL: http://katalog.we-online.de/em/datasheet/6130xx143121.pdf; Created by: Karrer Zheng
Q1 = MMBT2222A: BJT, SOT-23, 40V, 600mA, NPN, 0.25W, 150°C; MF: Diotec Semiconductor; SnapEDA_Link: https://www.snapeda.com/parts/MMBT2222A/Diotec/view-part/?ref=snap; Package: SOT-23 Diotec; Value: *; MP: MMBT2222A; Check_prices: https://www.snapeda.com/parts/MMBT2222A/Diotec/view-part/?ref=eda
R81-R84 R112 = Tro 0603 1% 10k: as R1 on sheet obc-v2_POWER; Kieu_Chan: *
TP6 = Test Point: Solder: NF